# Altium project audio_interface.PrjPcb (part 1 of 2)
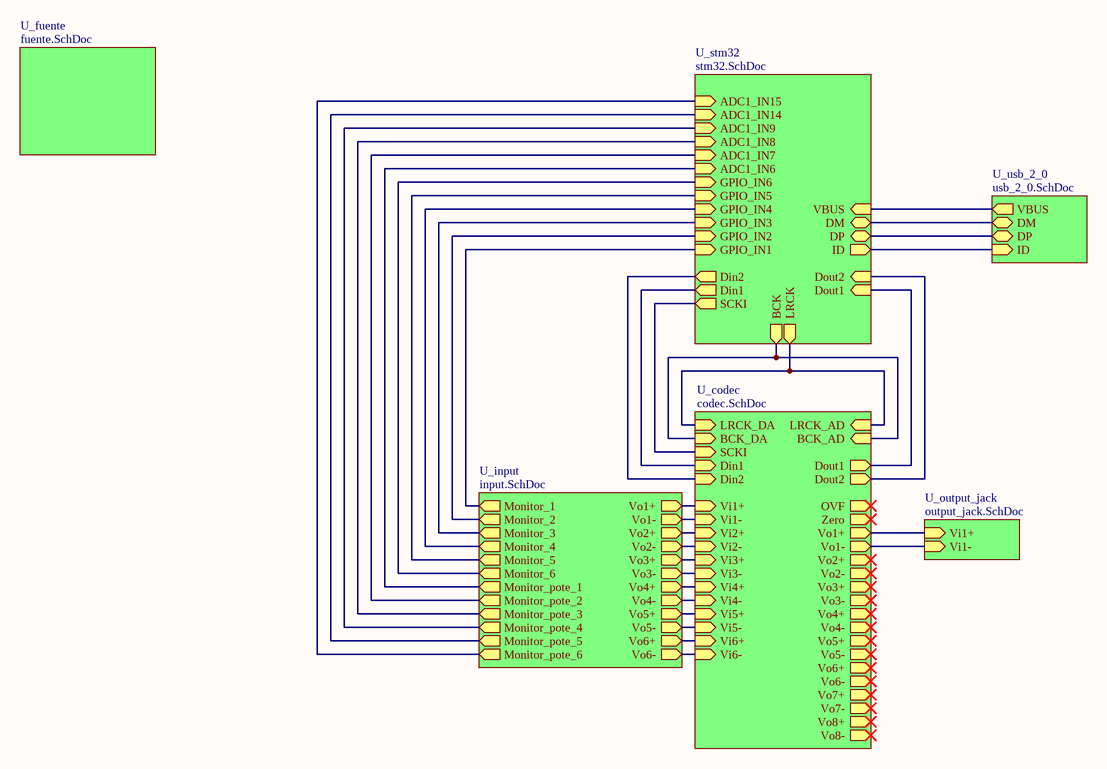
[diagram p0: audio_interface.SchDoc]
14 sheets, 456 parts. Net scope: hierarchical (ports join the sheet entries above them; power ports are global).
Board files: PCB2.PcbDoc, PCB1.PcbDoc, PCB3.PcbDoc
Sheets:
  audio_interface.SchDoc
    U_usb_2_0 = usb_2_0.SchDoc
    U_stm32 = stm32.SchDoc
    U_fuente = fuente.SchDoc
      U_phantom_power = phantom_power.SchDoc
    U_codec = codec.SchDoc
    U_output_jack = output_jack.SchDoc
    U_input = input.SchDoc
      U_input_output_1 = input_output.SchDoc
      U_att_17db_1 = att_17db.SchDoc
      U_preamp_1 = preamp.SchDoc
      U_preamp_2 = preamp.SchDoc
      U_bal2un_2 = bal2un_2.SchDoc
      U_bal2un_1 = bal2un_1.SchDoc
      U_preamp_3 = preamp.SchDoc
      U_phantom_power_enabler_1 = phantom_power_enabler.SchDoc
      U_input_output_2 = input_output.SchDoc
      U_att_17db_2 = att_17db.SchDoc
      U_phantom_power_enabler_2 = phantom_power_enabler.SchDoc
      U_input_output_3 = input_output.SchDoc
      U_att_17db_3 = att_17db.SchDoc
      U_phantom_power_enabler_3 = phantom_power_enabler.SchDoc
      U_input_output_4 = input_output.SchDoc
      U_att_17db_4 = att_17db.SchDoc
      U_phantom_power_enabler_4 = phantom_power_enabler.SchDoc
      U_input_output_5 = input_output.SchDoc
      U_att_17db_5 = att_17db.SchDoc
      U_phantom_power_enabler_5 = phantom_power_enabler.SchDoc
      U_input_output_6 = input_output.SchDoc
      U_att_17db_6 = att_17db.SchDoc
      U_phantom_power_enabler_6 = phantom_power_enabler.SchDoc

## Sheet audio_interface.SchDoc
size A4

### Sub-sheets
U_codec = codec.SchDoc: OVF (out), Vo1+ (out), Zero (out), Vo1- (out), Vo2+ (out), Vo3+ (out), Vo2- (out), Vo3- (out), Vo4+ (out), Vo4- (out), Vo5+ (out), Vo5- (out), Vo6+ (out), Vo7+ (out), Vo6- (out), Vo7- (out), Vo8+ (out), Vo8- (out), Vi1+ (in), Vi1- (in), Vi2+ (in), Vi2- (in), Vi3+ (in), Vi3- (in), Vi4+ (in), Vi4- (in), Vi5+ (in), Vi5- (in), Vi6+ (in), Vi6- (in), Dout1 (out), Dout2 (out), LRCK_DA (in), BCK_DA (in), SCKI (in), Din1 (in), Din2 (in), LRCK_AD (in), BCK_AD (in)
U_fuente = fuente.SchDoc: no entries
U_input = input.SchDoc: Vo1+ (out), Vo1- (out), Vo2+ (out), Vo2- (out), Vo3+ (out), Vo3- (out), Vo4+ (out), Vo4- (out), Vo5+ (out), Vo5- (out), Vo6+ (out), Vo6- (out), Monitor_1 (out), Monitor_pote_5 (out), Monitor_pote_3 (out), Monitor_3 (out), Monitor_4 (out), Monitor_pote_6 (out), Monitor_2 (out), Monitor_6 (out), Monitor_pote_1 (out), Monitor_pote_4 (out), Monitor_pote_2 (out), Monitor_5 (out)
U_output_jack = output_jack.SchDoc: Vi1+ (in), Vi1- (in)
U_stm32 = stm32.SchDoc: Din1 (out), Dout1 (in), BCK (out), LRCK (out), SCKI (out), Din2 (out), Dout2 (in), VBUS (in), DM (bidir), ID (out), DP (bidir), GPIO_IN4 (in), GPIO_IN6 (in), GPIO_IN2 (in), ADC1_IN9 (in), ADC1_IN6 (in), GPIO_IN1 (in), GPIO_IN3 (in), ADC1_IN8 (in), ADC1_IN14 (in), GPIO_IN5 (in), ADC1_IN15 (in), ADC1_IN7 (in)
U_usb_2_0 = usb_2_0.SchDoc: ID (in), DM (bidir), DP (bidir), VBUS (out)

### Nets
NetC33_1: sheet U_codec/Vi1+, sheet U_input/Vo1+
NetC34_1: sheet U_codec/Vi1-, sheet U_input/Vo1-
NetC37_1: sheet U_codec/Vi2+, sheet U_input/Vo2+
NetC38_1: sheet U_codec/Vi2-, sheet U_input/Vo2-
NetC39_1: sheet U_codec/Vi3+, sheet U_input/Vo3+
NetC40_1: sheet U_codec/Vi3-, sheet U_input/Vo3-
NetC41_1: sheet U_codec/Vi4+, sheet U_input/Vo4+
NetC42_1: sheet U_codec/Vi4-, sheet U_input/Vo4-
NetC43_1: sheet U_codec/Vi5+, sheet U_input/Vo5+
NetC44_1: sheet U_codec/Vi5-, sheet U_input/Vo5-
NetC45_1: sheet U_codec/Vi6+, sheet U_input/Vo6+
NetC46_1: sheet U_codec/Vi6-, sheet U_input/Vo6-
NetC49_1_1: sheet U_stm32/ADC1_IN6, sheet U_input/Monitor_pote_1
NetC49_2_1: sheet U_stm32/GPIO_IN2, sheet U_input/Monitor_2
NetC49_3_1: sheet U_stm32/ADC1_IN8, sheet U_input/Monitor_pote_3
NetC49_4_1: sheet U_stm32/ADC1_IN9, sheet U_input/Monitor_pote_4
NetC49_5_1: sheet U_stm32/GPIO_IN5, sheet U_input/Monitor_5
NetC49_6_1: sheet U_stm32/ADC1_IN15, sheet U_input/Monitor_pote_6
NetC50_1_1: sheet U_stm32/GPIO_IN1, sheet U_input/Monitor_1
NetC50_2_1: sheet U_stm32/ADC1_IN7, sheet U_input/Monitor_pote_2
NetC50_3_1: sheet U_stm32/GPIO_IN3, sheet U_input/Monitor_3
NetC50_4_1: sheet U_stm32/GPIO_IN4, sheet U_input/Monitor_4
NetC50_5_1: sheet U_stm32/ADC1_IN14, sheet U_input/Monitor_pote_5
NetC50_6_1: sheet U_stm32/GPIO_IN6, sheet U_input/Monitor_6
NetC62_2: sheet U_codec/Vo1+, sheet U_output_jack/Vi1+
NetC65_2: sheet U_codec/Vo1-, sheet U_output_jack/Vi1-
NetR4_2: sheet U_usb_2_0/VBUS, sheet U_stm32/VBUS
NetR5_2: sheet U_usb_2_0/DM, sheet U_stm32/DM
NetR6_2: sheet U_usb_2_0/DP, sheet U_stm32/DP
NetR7_2: sheet U_usb_2_0/ID, sheet U_stm32/ID
NetR12_2: sheet U_stm32/LRCK, sheet U_codec/LRCK_DA, sheet U_codec/LRCK_AD
NetR14_2: sheet U_stm32/BCK, sheet U_codec/BCK_DA, sheet U_codec/BCK_AD
NetR16_2: sheet U_stm32/SCKI, sheet U_codec/SCKI
NetR17_1: sheet U_stm32/Dout1, sheet U_codec/Dout1
NetR18_2: sheet U_stm32/Din1, sheet U_codec/Din1
NetR19_1: sheet U_stm32/Dout2, sheet U_codec/Dout2
NetR20_2: sheet U_stm32/Din2, sheet U_codec/Din2

### Notes on the sheet
- Title:
- Size:
- Author:
- A4
- Sheet
- of
- Revision:
- File:
- Date:

## Sheet usb_2_0.SchDoc
size A4
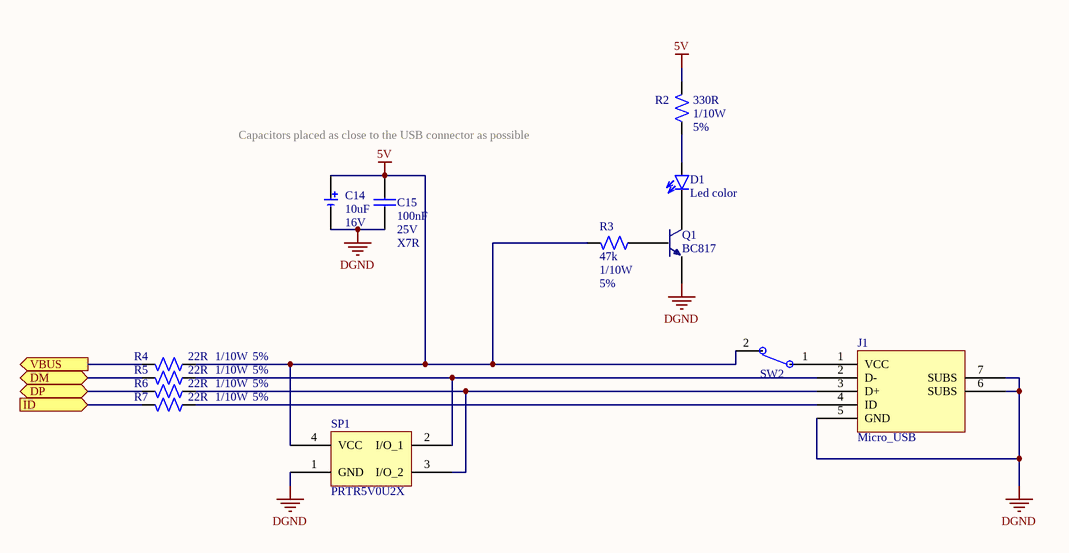
[diagram p1: usb_2_0.SchDoc]

### Parts
C14  Valor: 10uF  tension: 16V  [CAP_Electrolytic]  (hidden comment: Capacitor polarizado)
C15  valor: 100nF  tension: 25V  tolerancia: X7R  [C0805]  (hidden comment: Capacitor)
D1  Led color  [SMD_0805_Diodo]
J1  Micro_USB  [USB Type B]
Q1  BC817  [SOT23]
R2  Valor: 330R  Potencia: 1/10W  Tolerancia: 5%  [R0805]  (hidden comment: Resistor)
R3  Valor: 47k  Potencia: 1/10W  Tolerancia: 5%  [R0805]  (hidden comment: Resistor)
R4  Valor: 22R  Potencia: 1/10W  Tolerancia: 5%  [R0805]  (hidden comment: Resistor)
R5  Valor: 22R  Potencia: 1/10W  Tolerancia: 5%  [R0805]  (hidden comment: Resistor)
R6  Valor: 22R  Potencia: 1/10W  Tolerancia: 5%  [R0805]  (hidden comment: Resistor)
R7  Valor: 22R  Potencia: 1/10W  Tolerancia: 5%  [R0805]  (hidden comment: Resistor)
SP1  PRTR5V0U2X  [SOT143B]
SW2  OnOff_SW_SPST  [SPST_TH_SW_Button_90º]  (value not drawn)

### Ports
DM (bidir), DP (bidir), ID (in), VBUS (out)

### Nets
5V: C14.1 C15.1 R2.2 R3.2 R4.1 SP1.4(VCC) SW2.2
DGND: C14.2 C15.2 J1.5(GND) J1.6(SUBS) J1.7(SUBS) Q1.2 SP1.1(GND)
NetD1_1: D1.1 Q1.3
NetD1_2: D1.2 R2.1
NetJ1_1: J1.1(VCC) SW2.1
NetJ1_2: J1.2(D-) R5.1 SP1.2(I/O_1)
NetJ1_3: J1.3(D+) R6.1 SP1.3(I/O_2)
NetJ1_4: J1.4(ID) R7.1
NetQ1_1: Q1.1 R3.1
NetR4_2: R4.2 ; port VBUS
NetR5_2: R5.2 ; port DM
NetR6_2: R6.2 ; port DP
NetR7_2: R7.2 ; port ID

### Notes on the sheet
- Capacitors placed as close to the USB connector as possible

### Library data of the parts
C15 = Capacitor: Capacitor de placas paralelas; Encapsulado: 0805
D1 = Led: Encapsulado: SMD; Cod. Proveedor: 67-1549-1-ND; Proveedor: Digi-Key; Color: Verde; Link: https://www.digikey.com/product-detail/es/SML-LX0603GW-TR/67-1549-1-ND/304360?utm_campaign=buynow&WT.z_cid=ref_octopart_dkc_buynow&utm_medium=aggregator&curr=usd&site=us&utm_source=octopart
J1 = Micro_USB: Conector micro USB tipo B; pin to pad: 7>6; Cod. Proveedor: CO4821095; Proveedor: Elemon; Encapsulado: SMD B TYPE SIDE ENTRY; Fabricante: *; Link: *
Q1 = NPN: Cod. Proveedor: 1727-2918-1-ND; Encapsulado: TO-236AB; Proveedor: Digi-Key; Fabricante: Nexperia USA Inc.; Link: https://www.digikey.com/products/es?keywords=1727-2918-1-ND
R2-R7 = Resistor: Resistencia
SP1 = Double ESD: Double rail-to-rail ESD protection diode; Cod. Proveedor: 1727-3884-1-ND; Proveedor: Digi-Key; Encapsulado: SOT-143B; Link: https://www.digikey.com/product-detail/es/PRTR5V0U2X,215/1727-3884-1-ND/1589981?utm_campaign=buynow&WT.z_cid=ref_octopart_dkc_buynow&utm_medium=aggregator&curr=usd&site=us&utm_source=octopart
SW2 = OnOff_SW_SPST: Cod. Proveedor: EG2615-ND; Encapsulado: SMD; Proveedor: Digi-Key; Fabricante: E-Switch; Link: https://www.digikey.com/product-detail/en/e-switch/800SP9B6M6RE/EG2615-ND/502079
C14 = Capacitor polarizado: Link: *; Fabricante: *

## Sheet stm32.SchDoc
size A4
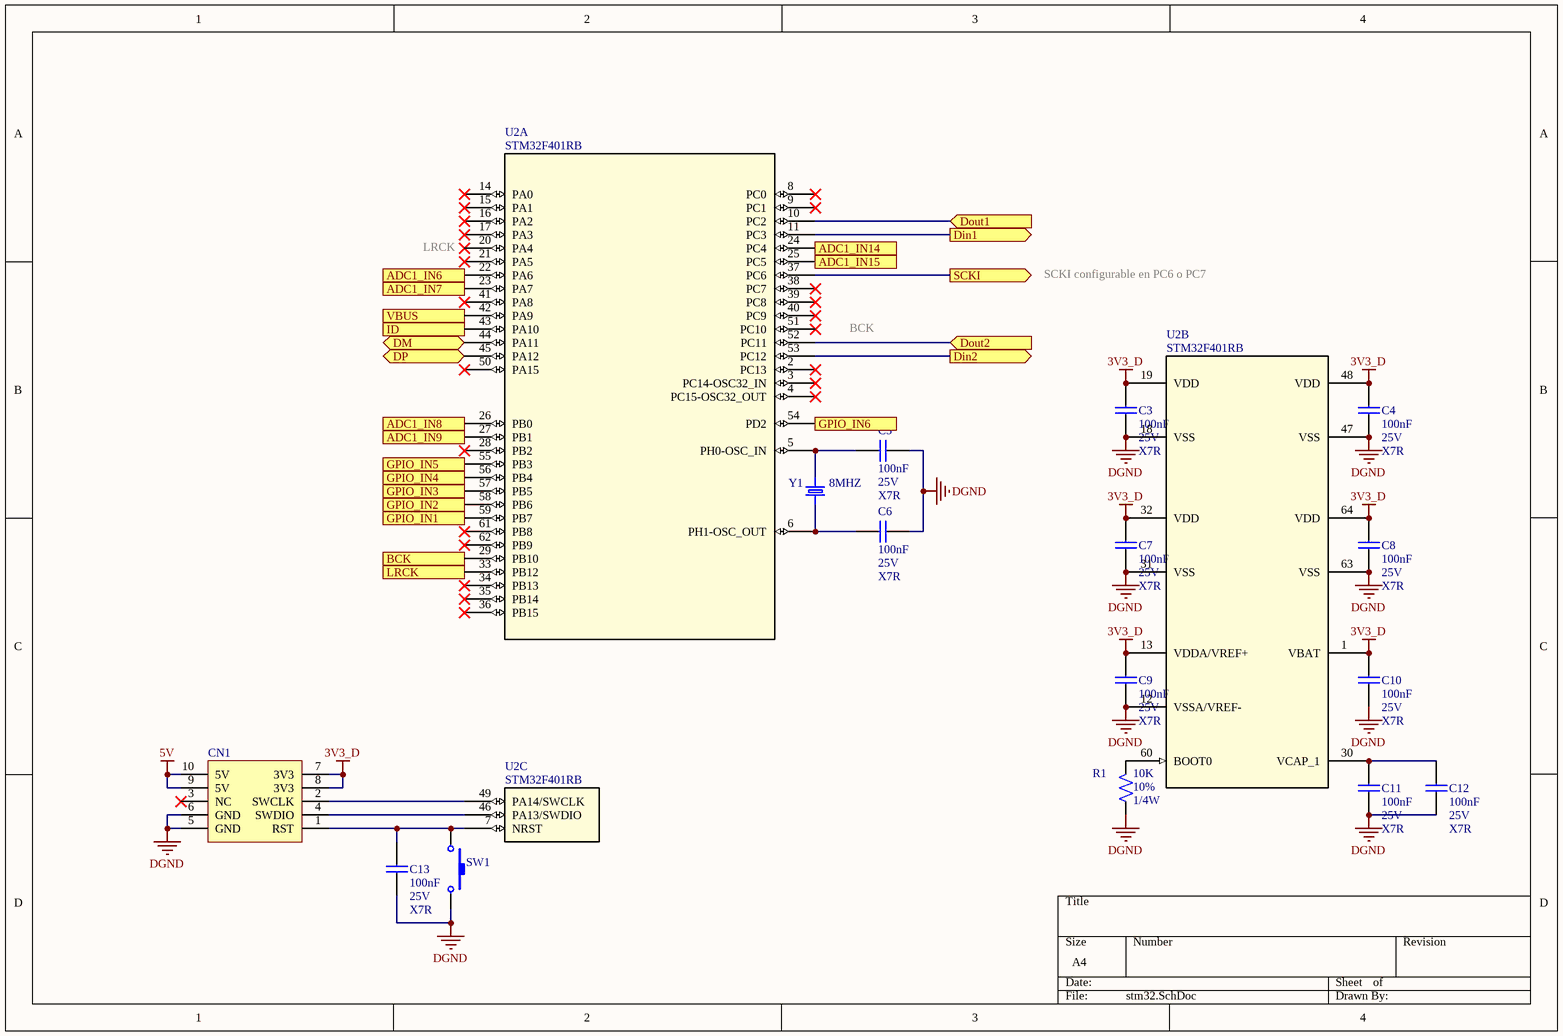
[diagram p2: stm32.SchDoc]

### Parts
C3  valor: 100nF  tension: 25V  tolerancia: X7R  [C0805]  (hidden comment: Capacitor)
C4  valor: 100nF  tension: 25V  tolerancia: X7R  [C0805]  (hidden comment: Capacitor)
C5  valor: 100nF  tension: 25V  tolerancia: X7R  [C0805]  (hidden comment: Capacitor)
C6  valor: 100nF  tension: 25V  tolerancia: X7R  [C0805]  (hidden comment: Capacitor)
C7  valor: 100nF  tension: 25V  tolerancia: X7R  [C0805]  (hidden comment: Capacitor)
C8  valor: 100nF  tension: 25V  tolerancia: X7R  [C0805]  (hidden comment: Capacitor)
C9  valor: 100nF  tension: 25V  tolerancia: X7R  [C0805]  (hidden comment: Capacitor)
C10  valor: 100nF  tension: 25V  tolerancia: X7R  [C0805]  (hidden comment: Capacitor)
C11  valor: 100nF  tension: 25V  tolerancia: X7R  [C0805]  (hidden comment: Capacitor)
C12  valor: 100nF  tension: 25V  tolerancia: X7R  [C0805]  (hidden comment: Capacitor)
C13  valor: 100nF  tension: 25V  tolerancia: X7R  [C0805]  (hidden comment: Capacitor)
CN1  STLINK V2 Mini_2  [IDC10M]  (value not drawn)
R1  Valor: 10K  Potencia: 1/4W  Tolerancia: 10%  [R0805]  (hidden comment: Resistor)
SW1  TAC_SWITCH_4  [TAC_SW_4]  (value not drawn)
U2  STM32F401RB  [LQFP64-10x10mm]  (parts A,B,C of 3)
Y1  frecuencia: 8MHZ  [XTAL_HC49/US_HS]  (hidden comment: XTAL)

### Ports
ADC1_IN6 (in), ADC1_IN7 (in), ADC1_IN8 (in), ADC1_IN9 (in), ADC1_IN14 (in), ADC1_IN15 (in), BCK (out), Din1 (out), Din2 (out), DM (bidir), Dout1 (in), Dout2 (in), DP (bidir), GPIO_IN1 (in), GPIO_IN2 (in), GPIO_IN3 (in), GPIO_IN4 (in), GPIO_IN5 (in), GPIO_IN6 (in), ID (out), LRCK (out), SCKI (out), VBUS (in)

### Nets
3V3_D: C3.1 C4.1 C7.1 C8.1 C9.1 C10.1 CN1.7(3V3) CN1.8(3V3) U2.1(VBAT) U2.13(VDDA/VREF+) U2.19(VDD) U2.32(VDD) U2.48(VDD) U2.64(VDD)
5V: CN1.9(5V) CN1.10(5V)
DGND: C3.2 C4.2 C5.1 C6.1 C7.2 C8.2 C9.2 C10.2 C11.2 C12.2 C13.2 CN1.5(GND) CN1.6(GND) R1.1 SW1.2 U2.12(VSSA/VREF-) U2.18(VSS) U2.31(VSS) U2.47(VSS) U2.63(VSS)
NetC5_2: C5.2 U2.5(PH0-OSC_IN) Y1.1
NetC6_2: C6.2 U2.6(PH1-OSC_OUT) Y1.2
NetC11_1: C11.1 C12.1 U2.30(VCAP_1)
NetC13_1: C13.1 CN1.1(RST) SW1.1 U2.7(NRST)
NetC49_1_1: U2.22(PA6) ; port ADC1_IN6
NetC49_2_1: U2.58(PB6) ; port GPIO_IN2
NetC49_3_1: U2.26(PB0) ; port ADC1_IN8
NetC49_4_1: U2.27(PB1) ; port ADC1_IN9
NetC49_5_1: U2.55(PB3) ; port GPIO_IN5
NetC49_6_1: U2.25(PC5) ; port ADC1_IN15
NetC50_1_1: U2.59(PB7) ; port GPIO_IN1
NetC50_2_1: U2.23(PA7) ; port ADC1_IN7
NetC50_3_1: U2.57(PB5) ; port GPIO_IN3
NetC50_4_1: U2.56(PB4) ; port GPIO_IN4
NetC50_5_1: U2.24(PC4) ; port ADC1_IN14
NetC50_6_1: U2.54(PD2) ; port GPIO_IN6
NetCN1_2: CN1.2(SWCLK) U2.49(PA14/SWCLK)
NetCN1_4: CN1.4(SWDIO) U2.46(PA13/SWDIO)
NetR1_2: R1.2 U2.60(BOOT0)
NetR4_2: U2.42(PA9) ; port VBUS
NetR5_2: U2.44(PA11) ; port DM
NetR6_2: U2.45(PA12) ; port DP
NetR7_2: U2.43(PA10) ; port ID
NetR12_2: U2.33(PB12) ; port LRCK
NetR14_2: U2.29(PB10) ; port BCK
NetR16_2: U2.37(PC6) ; port SCKI
NetR17_1: U2.10(PC2) ; port Dout1
NetR18_2: U2.11(PC3) ; port Din1
NetR19_1: U2.52(PC11) ; port Dout2
NetR20_2: U2.53(PC12) ; port Din2

Not connected (* = marked no-connect by the designer): CN1 3(NC)*; U2 2(PC13)* 3(PC14-OSC32_IN)* 4(PC15-OSC32_OUT)* 8(PC0)* 9(PC1)* 14(PA0)* 15(PA1)* 16(PA2)* 17(PA3)* 20(PA4)* 21(PA5)* 28(PB2)* 34(PB13)* 35(PB14)* 36(PB15)* 38(PC7)* 39(PC8)* 40(PC9)* 41(PA8)* 50(PA15)* 51(PC10)* 61(PB8)* 62(PB9)*

### Notes on the sheet
- LRCK
- SCKI configurable en PC6 o PC7
- BCK

### Library data of the parts
C3-C13 = Capacitor: as C15 on sheet usb_2_0
CN1 = STLINK V2 Mini_2: STLINK V2 Mini; Link: *; Fabricante: *
R1 = Resistor: Resistencia
SW1 = TAC_SWITCH_4: Pulsador de 4 pines
U2 = STM32F4xxR2: Vendor: STMicroelectronics; _BOOT0=1: 1: System memory is selected as boot space; _BOOT0=0: 0: Main Flash memory is selected as boot space; _VDD: Capa de 100nF; _BOOT0: conectado a VDD o DGND a traves de R=10K; Proveedor: Digi-Key; Cod. Proveedor: 497-17428-ND; Encapsulado: 64-LQFP; Manufacturer_Part_Number: stm32f4xxr2; Value: Value; Link: https://www.digikey.com/product-detail/es/STM32F401RBT6/497-17428-ND/4755972?utm_campaign=buynow&WT.z_cid=ref_octopart_dkc_buynow&utm_medium=aggregator&curr=usd&site=us&utm_source=octopart; Manufacturer: STMicroelectronics
Y1 = XTAL: Resonador cerámico

## Sheet fuente.SchDoc
size A4
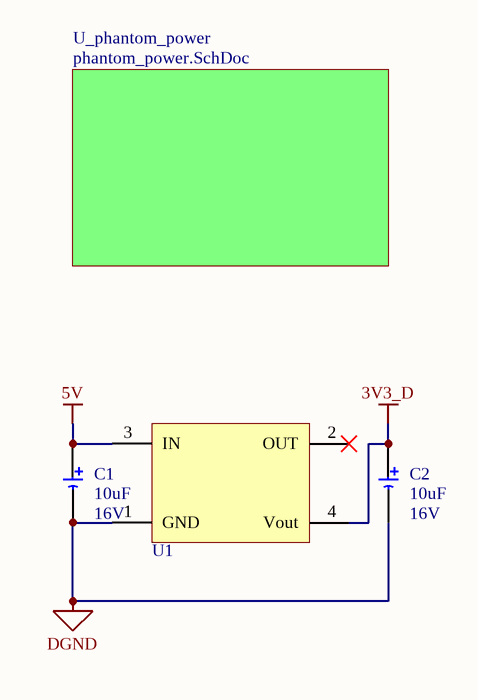
[diagram p3: fuente.SchDoc]

### Parts
C1  Valor: 10uF  tension: 16V  [CAP_Electrolytic]  (hidden comment: Capacitor polarizado)
C2  Valor: 10uF  tension: 16V  [CAP_Electrolytic]  (hidden comment: Capacitor polarizado)
U1  LM1117  [SOT223]  (value not drawn)

### Sub-sheets
U_phantom_power = phantom_power.SchDoc: no entries

### Nets
3V3_D: C2.1 U1.4(Vout)
5V: C1.1 U1.3(IN)
DGND: C1.2 C2.2 U1.1(GND)

Not connected (* = marked no-connect by the designer): U1 2(OUT)*

### Library data of the parts
U1 = LM1117: LDO Regulator; Cod. Proveedor: LM1117IMP-ADJ/NOPBCT-ND; Proveedor: Digi-Key; Encapsulado: SOT-223-4; Fabricante: Texas Instruments; Link: https://www.digikey.com/product-detail/es/LM1117IMP-ADJ-NOPB/LM1117IMP-ADJ-NOPBCT-ND/483060?utm_campaign=buynow&WT.z_cid=ref_octopart_dkc_buynow&utm_medium=aggregator&curr=usd&site=us&utm_source=octopart
C1 C2 = Capacitor polarizado: Link: *; Fabricante: *

## Sheet phantom_power.SchDoc
size A4
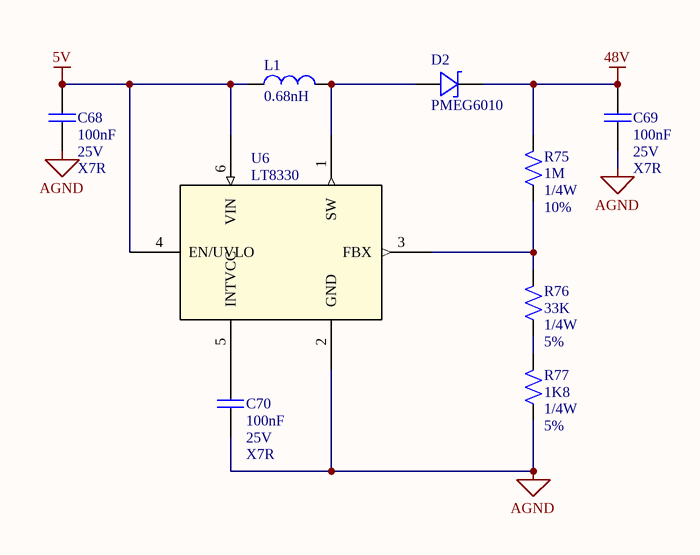
[diagram p4: phantom_power.SchDoc]

### Parts
C68  valor: 100nF  tension: 25V  tolerancia: X7R  [C0805]  (hidden comment: Capacitor)
C69  valor: 100nF  tension: 25V  tolerancia: X7R  [C0805]  (hidden comment: Capacitor)
C70  valor: 100nF  tension: 25V  tolerancia: X7R  [C0805]  (hidden comment: Capacitor)
D2  PMEG6010  [SOD128]
L1  0.68nH  [L0805]
R75  Valor: 1M  Potencia: 1/4W  Tolerancia: 10%  [R0805]  (hidden comment: Resistor)
R76  Valor: 33K  Potencia: 1/4W  Tolerancia: 5%  [R0805]  (hidden comment: Resistor)
R77  Valor: 1K8  Potencia: 1/4W  Tolerancia: 5%  [R0805]  (hidden comment: Resistor)
U6  LT8330  [S6]

### Nets
5V: C68.1 L1.1 U6.4(EN/UVLO) U6.6(VIN)
48V: C69.1 D2.1 R75.2
AGND: C68.2 C69.2 C70.2 R77.1 U6.2(GND)
NetC70_1: C70.1 U6.5(INTVCC)
NetD2_2: D2.2 L1.2 U6.1(SW)
NetR75_1: R75.1 R76.2 U6.3(FBX)
NetR76_1: R76.1 R77.2

### Library data of the parts
C68-C70 = Capacitor: as C15 on sheet usb_2_0
D2 = Schottky Diode: Cod. Proveedor: 1727-5845-1-ND; Encapsulado: SOD-128; Proveedor: Digi-Key; Fabricante: Nexperia; Link: https://www.digikey.com/product-detail/es/PMEG6010EP,115/1727-5845-1-ND/2697507?utm_campaign=buynow&WT.z_cid=ref_octopart_dkc_buynow&utm_medium=aggregator&curr=usd&site=us&utm_source=octopart
L1 = Inductor: Encapsulado: SMD; Proveedor: Digi-Key; Cod. Proveedor: 478-7137-1-ND; Fabricante: AVX Corporation; Valor: 0.68nH; Link: https://www.digikey.com/product-detail/es/L0201R68AHSTR/500/478-7137-1-ND/3455469?utm_campaign=buynow&WT.z_cid=ref_octopart_dkc_buynow&utm_medium=aggregator&curr=usd&site=us&utm_source=octopart
R75-R77 = Resistor: Resistencia
U6 = LT8330: Low IQ Boost/SEPIC/Inverting Converter with 1A, 60V Switch; Fabricante: Linear Technology/Analog Devices; Cod. Proveedor: LT8330ES6#TRMPBFCT-ND; Encapsulado: TSOT-23-6; Proveedor: Digi-Key; Link: https://www.digikey.com/product-detail/es/LT8330ES6%2523TRMPBF/LT8330ES6%2523TRMPBFCT-ND/5361671?utm_campaign=buynow&WT.z_cid=ref_octopart_dkc_buynow&utm_medium=aggregator&curr=usd&site=us&utm_source=octopart

## Sheet codec.SchDoc
size A4
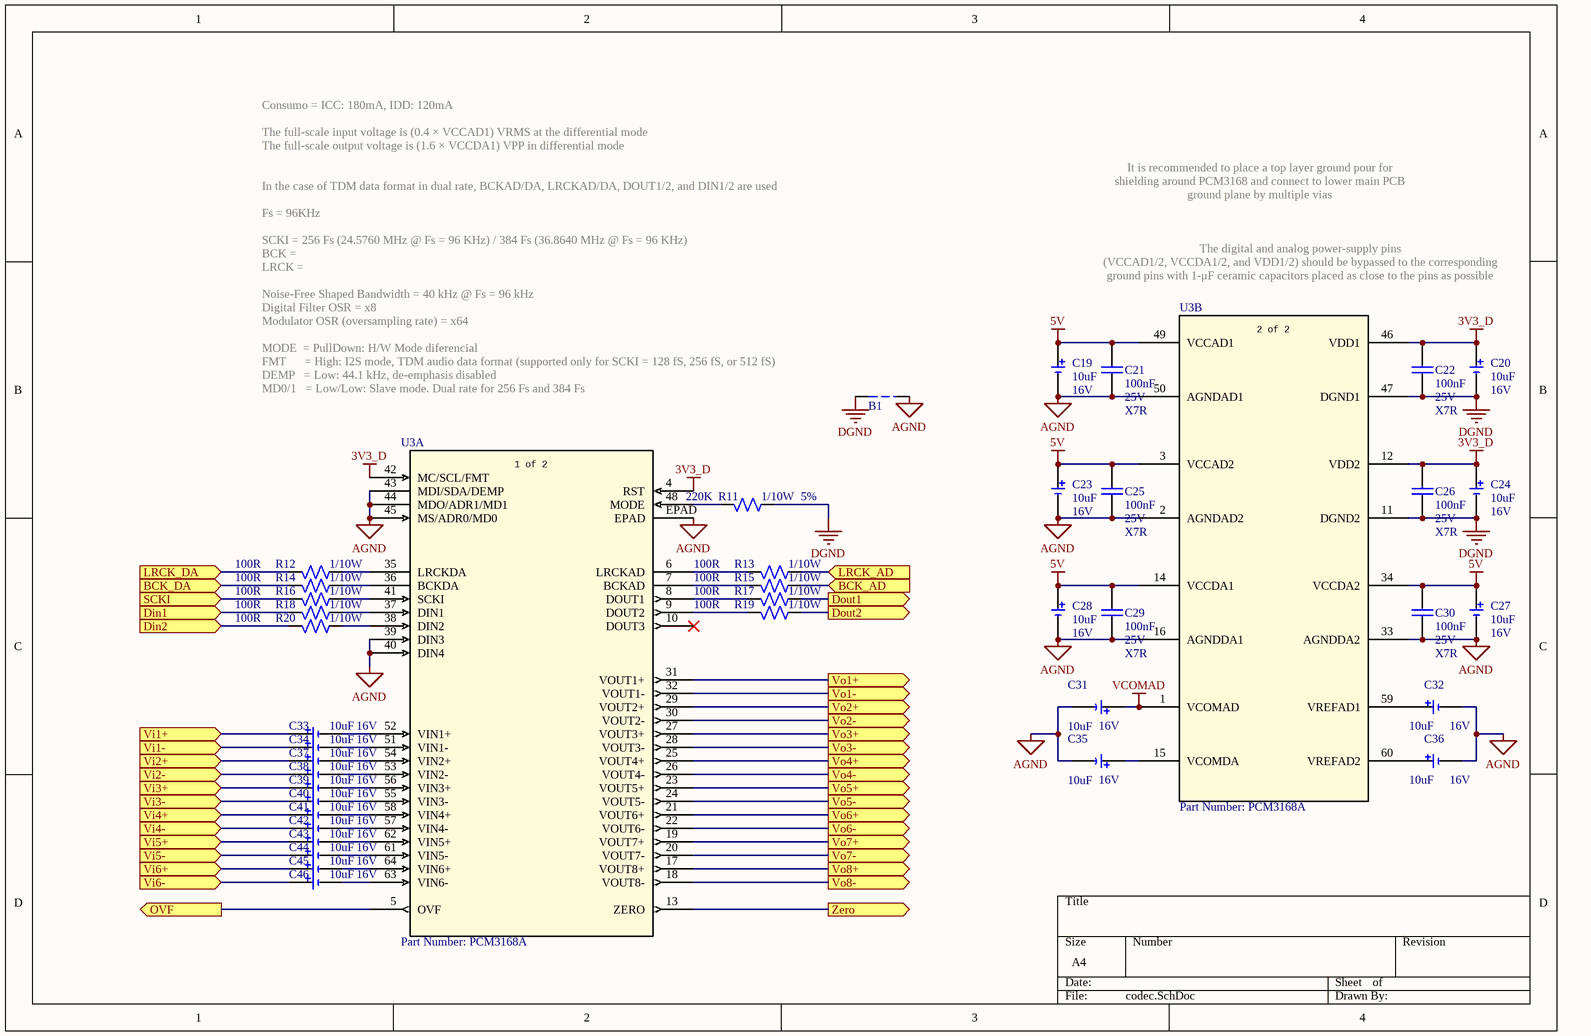
[diagram p5: codec.SchDoc]

### Parts
B1  GND_BIND  [Track_8mil]  (value not drawn)
C19  Valor: 10uF  tension: 16V  [CAP_Electrolytic]  (hidden comment: Capacitor polarizado)
C20  Valor: 10uF  tension: 16V  [CAP_Electrolytic]  (hidden comment: Capacitor polarizado)
C21  valor: 100nF  tension: 25V  tolerancia: X7R  [C0805]  (hidden comment: Capacitor)
C22  valor: 100nF  tension: 25V  tolerancia: X7R  [C0805]  (hidden comment: Capacitor)
C23  Valor: 10uF  tension: 16V  [CAP_Electrolytic]  (hidden comment: Capacitor polarizado)
C24  Valor: 10uF  tension: 16V  [CAP_Electrolytic]  (hidden comment: Capacitor polarizado)
C25  valor: 100nF  tension: 25V  tolerancia: X7R  [C0805]  (hidden comment: Capacitor)
C26  valor: 100nF  tension: 25V  tolerancia: X7R  [C0805]  (hidden comment: Capacitor)
C27  Valor: 10uF  tension: 16V  [CAP_Electrolytic]  (hidden comment: Capacitor polarizado)
C28  Valor: 10uF  tension: 16V  [CAP_Electrolytic]  (hidden comment: Capacitor polarizado)
C29  valor: 100nF  tension: 25V  tolerancia: X7R  [C0805]  (hidden comment: Capacitor)
C30  valor: 100nF  tension: 25V  tolerancia: X7R  [C0805]  (hidden comment: Capacitor)
C31  Valor: 10uF  tension: 16V  [CAP_Electrolytic]  (hidden comment: Capacitor polarizado)
C32  Valor: 10uF  tension: 16V  [CAP_Electrolytic]  (hidden comment: Capacitor polarizado)
C33  Valor: 10uF  tension: 16V  [CAP_Electrolytic]  (hidden comment: Capacitor polarizado)
C34  Valor: 10uF  tension: 16V  [CAP_Electrolytic]  (hidden comment: Capacitor polarizado)
C35  Valor: 10uF  tension: 16V  [CAP_Electrolytic]  (hidden comment: Capacitor polarizado)
C36  Valor: 10uF  tension: 16V  [CAP_Electrolytic]  (hidden comment: Capacitor polarizado)
C37  Valor: 10uF  tension: 16V  [CAP_Electrolytic]  (hidden comment: Capacitor polarizado)
C38  Valor: 10uF  tension: 16V  [CAP_Electrolytic]  (hidden comment: Capacitor polarizado)
C39  Valor: 10uF  tension: 16V  [CAP_Electrolytic]  (hidden comment: Capacitor polarizado)
C40  Valor: 10uF  tension: 16V  [CAP_Electrolytic]  (hidden comment: Capacitor polarizado)
C41  Valor: 10uF  tension: 16V  [CAP_Electrolytic]  (hidden comment: Capacitor polarizado)
C42  Valor: 10uF  tension: 16V  [CAP_Electrolytic]  (hidden comment: Capacitor polarizado)
C43  Valor: 10uF  tension: 16V  [CAP_Electrolytic]  (hidden comment: Capacitor polarizado)
C44  Valor: 10uF  tension: 16V  [CAP_Electrolytic]  (hidden comment: Capacitor polarizado)
C45  Valor: 10uF  tension: 16V  [CAP_Electrolytic]  (hidden comment: Capacitor polarizado)
C46  Valor: 10uF  tension: 16V  [CAP_Electrolytic]  (hidden comment: Capacitor polarizado)
R11  Valor: 220K  Potencia: 1/10W  Tolerancia: 5%  [R0805]  (hidden comment: Resistor)
R12  Valor: 100R  Potencia: 1/10W  [R0805]  (hidden comment: Resistor)
R13  Valor: 100R  Potencia: 1/10W  [R0805]  (hidden comment: Resistor)
R14  Valor: 100R  Potencia: 1/10W  [R0805]  (hidden comment: Resistor)
R15  Valor: 100R  Potencia: 1/10W  [R0805]  (hidden comment: Resistor)
R16  Valor: 100R  Potencia: 1/10W  [R0805]  (hidden comment: Resistor)
R17  Valor: 100R  Potencia: 1/10W  [R0805]  (hidden comment: Resistor)
R18  Valor: 100R  Potencia: 1/10W  [R0805]  (hidden comment: Resistor)
R19  Valor: 100R  Potencia: 1/10W  [R0805]  (hidden comment: Resistor)
R20  Valor: 100R  Potencia: 1/10W  [R0805]  (hidden comment: Resistor)
U3  Part Number: PCM3168A  [PAP64_7X7P26]  (parts A,B of 2)

### Ports
BCK_AD (in), BCK_DA (in), Din1 (in), Din2 (in), Dout1 (out), Dout2 (out), LRCK_AD (in), LRCK_DA (in), OVF (out), SCKI (in), Vi1+ (in), Vi1- (in), Vi2+ (in), Vi2- (in), Vi3+ (in), Vi3- (in), Vi4+ (in), Vi4- (in), Vi5+ (in), Vi5- (in), Vi6+ (in), Vi6- (in), Vo1+ (out), Vo1- (out), Vo2+ (out), Vo2- (out), Vo3+ (out), Vo3- (out), Vo4+ (out), Vo4- (out), Vo5+ (out), Vo5- (out), Vo6+ (out), Vo6- (out), Vo7+ (out), Vo7- (out), Vo8+ (out), Vo8- (out), Zero (out)

### Nets
3V3_D: C20.1 C22.1 C24.1 C26.1 U3.4(RST) U3.12(VDD2) U3.42(MC/SCL/FMT) U3.46(VDD1)
5V: C19.1 C21.1 C23.1 C25.1 C27.1 C28.1 C29.1 C30.1 U3.3(VCCAD2) U3.14(VCCDA1) U3.34(VCCDA2) U3.49(VCCAD1)
AGND: B1.1 C19.2 C21.2 C23.2 C25.2 C27.2 C28.2 C29.2 C30.2 C31.2 C32.2 C35.2 C36.2 U3.2(AGNDAD2) U3.16(AGNDDA1) U3.33(AGNDDA2) U3.39(DIN3) U3.40(DIN4) U3.43(MDI/SDA/DEMP) U3.44(MDO/ADR1/MD1) U3.45(MS/ADR0/MD0) U3.50(AGNDAD1) U3.EPAD
DGND: B1.2 C20.2 C22.2 C24.2 C26.2 R11.1 U3.11(DGND2) U3.47(DGND1)
VCOMAD: C31.1 U3.1(VCOMAD)
NetC32_1: C32.1 U3.59(VREFAD1)
NetC33_1: C33.1 ; port Vi1+
NetC33_2: C33.2 U3.52(VIN1+)
NetC34_1: C34.1 ; port Vi1-
NetC34_2: C34.2 U3.51(VIN1-)
NetC35_1: C35.1 U3.15(VCOMDA)
NetC36_1: C36.1 U3.60(VREFAD2)
NetC37_1: C37.1 ; port Vi2+
NetC37_2: C37.2 U3.54(VIN2+)
NetC38_1: C38.1 ; port Vi2-
NetC38_2: C38.2 U3.53(VIN2-)
NetC39_1: C39.1 ; port Vi3+
NetC39_2: C39.2 U3.56(VIN3+)
NetC40_1: C40.1 ; port Vi3-
NetC40_2: C40.2 U3.55(VIN3-)
NetC41_1: C41.1 ; port Vi4+
NetC41_2: C41.2 U3.58(VIN4+)
NetC42_1: C42.1 ; port Vi4-
NetC42_2: C42.2 U3.57(VIN4-)
NetC43_1: C43.1 ; port Vi5+
NetC43_2: C43.2 U3.62(VIN5+)
NetC44_1: C44.1 ; port Vi5-
NetC44_2: C44.2 U3.61(VIN5-)
NetC45_1: C45.1 ; port Vi6+
NetC45_2: C45.2 U3.64(VIN6+)
NetC46_1: C46.1 ; port Vi6-
NetC46_2: C46.2 U3.63(VIN6-)
NetC62_2: U3.31(VOUT1+) ; port Vo1+
NetC65_2: U3.32(VOUT1-) ; port Vo1-
NetR11_2: R11.2 U3.48(MODE)
NetR12_1: R12.1 U3.35(LRCKDA)
NetR12_2: R12.2 R13.1 ; port LRCK_AD, port LRCK_DA
NetR13_2: R13.2 U3.6(LRCKAD)
NetR14_1: R14.1 U3.36(BCKDA)
NetR14_2: R14.2 R15.1 ; port BCK_AD, port BCK_DA
NetR15_2: R15.2 U3.7(BCKAD)
NetR16_1: R16.1 U3.41(SCKI)
NetR16_2: R16.2 ; port SCKI
NetR17_1: R17.1 ; port Dout1
NetR17_2: R17.2 U3.8(DOUT1)
NetR18_1: R18.1 U3.37(DIN1)
NetR18_2: R18.2 ; port Din1
NetR19_1: R19.1 ; port Dout2
NetR19_2: R19.2 U3.9(DOUT2)
NetR20_1: R20.1 U3.38(DIN2)
NetR20_2: R20.2 ; port Din2
NetU3_5: U3.5(OVF) ; port OVF
NetU3_13: U3.13(ZERO) ; port Zero
NetU3_17: U3.17(VOUT8+) ; port Vo8+
NetU3_18: U3.18(VOUT8-) ; port Vo8-
NetU3_19: U3.19(VOUT7+) ; port Vo7+
NetU3_20: U3.20(VOUT7-) ; port Vo7-
NetU3_21: U3.21(VOUT6+) ; port Vo6+
NetU3_22: U3.22(VOUT6-) ; port Vo6-
NetU3_23: U3.23(VOUT5+) ; port Vo5+
NetU3_24: U3.24(VOUT5-) ; port Vo5-
NetU3_25: U3.25(VOUT4+) ; port Vo4+
NetU3_26: U3.26(VOUT4-) ; port Vo4-
NetU3_27: U3.27(VOUT3+) ; port Vo3+
NetU3_28: U3.28(VOUT3-) ; port Vo3-
NetU3_29: U3.29(VOUT2+) ; port Vo2+
NetU3_30: U3.30(VOUT2-) ; port Vo2-

Not connected (* = marked no-connect by the designer): U3 10(DOUT3)*

### Notes on the sheet
- Consumo = ICC: 180mA, IDD: 120mA
- The full-scale output voltage is (1.6 × VCCDA1) VPP in differential mode
- The full-scale input voltage is (0.4 × VCCAD1) VRMS at the differential mode
- It is recommended to place a top layer ground pour for
- shielding around PCM3168 and connect to lower main PCB
- SCKI = 256 Fs (24.5760 MHz @ Fs = 96 KHz) / 384 Fs (36.8640 MHz @ Fs = 96 KHz)
- Fs = 96KHz
- In the case of TDM data format in dual rate, BCKAD/DA, LRCKAD/DA, DOUT1/2, and DIN1/2 are used
- ground plane by multiple vias
- The digital and analog power-supply pins
- Noise-Free Shaped Bandwidth = 40 kHz @ Fs = 96 kHz
- Digital Filter OSR = x8
- BCK =
- LRCK =
- (VCCAD1/2, VCCDA1/2, and VDD1/2) should be bypassed to the corresponding
- ground pins with 1-μF ceramic capacitors placed as close to the pins as possible
- MODE  = PullDown: H/W Mode diferencial
- DEMP   = Low: 44.1 kHz, de-emphasis disabled
- (near B1) FMT      = High: I2S mode, TDM audio data format (supported only for SCKI = 128 fS, 256 fS, or 512 fS)
- Modulator OSR (oversampling rate) = x64
- MD0/1   = Low/Low: Slave mode. Dual rate for 256 Fs and 384 Fs
- (in symbol PCM3168A-Q1_PAP_, part A) 1 of 2
- (in symbol PCM3168A-Q1_PAP_, part B) 2 of 2

### Library data of the parts
B1 = GND_BIND: Conecta distintos planos de masa por una pista
C21 C22 C25 C26 C29 C30 = Capacitor: as C15 on sheet usb_2_0
R11-R20 = Resistor: Resistencia
U3 = PCM3168A-Q1_PAP_: Manufacturer: Texas Instruments; Manufacturer_Part_Number: PCM3168A-Q1_PAP_64; Vendor: Texas Instruments; Cod. Proveedor: *; Encapsulado: *; Link: *; Proveedor: *
C19 C20 C23 C24 C27 C28 C31-C46 = Capacitor polarizado: Link: *; Fabricante: *

## Sheet output_jack.SchDoc
size A4
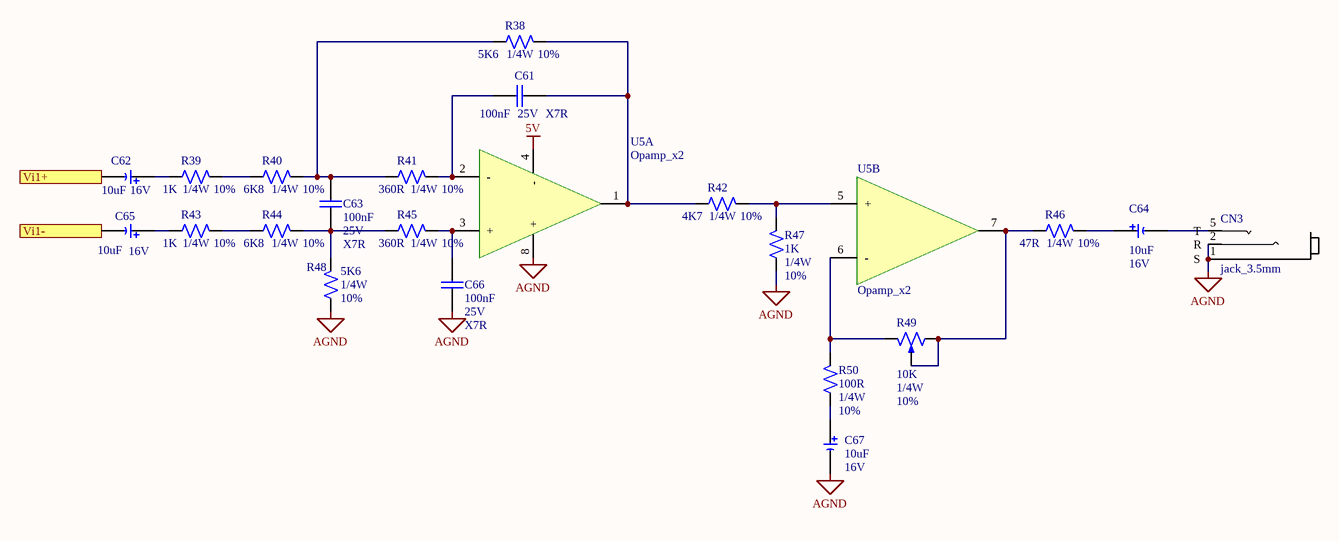
[diagram p6: output_jack.SchDoc]

### Parts
C61  valor: 100nF  tension: 25V  tolerancia: X7R  [C0805]  (hidden comment: Capacitor)
C62  Valor: 10uF  tension: 16V  [CAP_Electrolytic]  (hidden comment: Capacitor polarizado)
C63  valor: 100nF  tension: 25V  tolerancia: X7R  [C0805]  (hidden comment: Capacitor)
C64  Valor: 10uF  tension: 16V  [CAP_Electrolytic]  (hidden comment: Capacitor polarizado)
C65  Valor: 10uF  tension: 16V  [CAP_Electrolytic]  (hidden comment: Capacitor polarizado)
C66  valor: 100nF  tension: 25V  tolerancia: X7R  [C0805]  (hidden comment: Capacitor)
C67  Valor: 10uF  tension: 16V  [CAP_Electrolytic]  (hidden comment: Capacitor polarizado)
CN3  jack_3.5mm  [Jack 3.5mm]
R38  Valor: 5K6  Potencia: 1/4W  Tolerancia: 10%  [R0805]  (hidden comment: Resistor)
R39  Valor: 1K  Potencia: 1/4W  Tolerancia: 10%  [R0805]  (hidden comment: Resistor)
R40  Valor: 6K8  Potencia: 1/4W  Tolerancia: 10%  [R0805]  (hidden comment: Resistor)
R41  Valor: 360R  Potencia: 1/4W  Tolerancia: 10%  [R0805]  (hidden comment: Resistor)
R42  Valor: 4K7  Potencia: 1/4W  Tolerancia: 10%  [R0805]  (hidden comment: Resistor)
R43  Valor: 1K  Potencia: 1/4W  Tolerancia: 10%  [R0805]  (hidden comment: Resistor)
R44  Valor: 6K8  Potencia: 1/4W  Tolerancia: 10%  [R0805]  (hidden comment: Resistor)
R45  Valor: 360R  Potencia: 1/4W  Tolerancia: 10%  [R0805]  (hidden comment: Resistor)
R46  Valor: 47R  Potencia: 1/4W  Tolerancia: 10%  [R0805]  (hidden comment: Resistor)
R47  Valor: 1K  Potencia: 1/4W  Tolerancia: 10%  [R0805]  (hidden comment: Resistor)
R48  Valor: 5K6  Potencia: 1/4W  Tolerancia: 10%  [R0805]  (hidden comment: Resistor)
R49  valor: 10K  Potencia: 1/4W  Tolerancia: 10%  [Header 3x1]  (hidden comment: Potenciometro)
R50  Valor: 100R  Potencia: 1/4W  Tolerancia: 10%  [R0805]  (hidden comment: Resistor)
U5  Opamp_x2  [D8]  (parts A,B of 2)

### Ports
Vi1+ (in), Vi1- (in)

### Nets
5V: U5.4(-)
AGND: C66.2 C67.2 CN3.1(S) CN3.2(R) R47.1 R48.1 U5.8(+)
NetC61_1: C61.1 R38.2 R42.1 U5.1(OUT)
NetC61_2: C61.2 R41.2 U5.2(-)
NetC62_1: C62.1 R39.1
NetC62_2: C62.2 ; port Vi1+
NetC63_1: C63.1 R38.1 R40.2 R41.1
NetC63_2: C63.2 R44.2 R45.1 R48.2
NetC64_1: C64.1 R46.2
NetC64_2: C64.2 CN3.5(T)
NetC65_1: C65.1 R43.1
NetC65_2: C65.2 ; port Vi1-
NetC66_1: C66.1 R45.2 U5.3(+)
NetC67_1: C67.1 R50.1
NetR39_2: R39.2 R40.1
NetR42_2: R42.2 R47.2 U5.5(+)
NetR43_2: R43.2 R44.1
NetR46_1: R46.1 R49.2(Punto_medio) R49.3(Right) U5.7(OUT)
NetR49_1: R49.1(Left) R50.2 U5.6(-)

### Library data of the parts
C61 C63 C66 = Capacitor: as C15 on sheet usb_2_0
R38-R48 R50 = Resistor: Resistencia
R49 = Potenciometer: Link: *; Fabricante: *
U5 = Opamp_x2: Integrado con 2 operacionales
C62 C64 C65 C67 = Capacitor polarizado: Link: *; Fabricante: *
CN3 = jack_3.5mm: Cod. Proveedor: *; Encapsulado: *; Link: *; Proveedor: *; Fabricante: *

## Sheet input.SchDoc
size A4
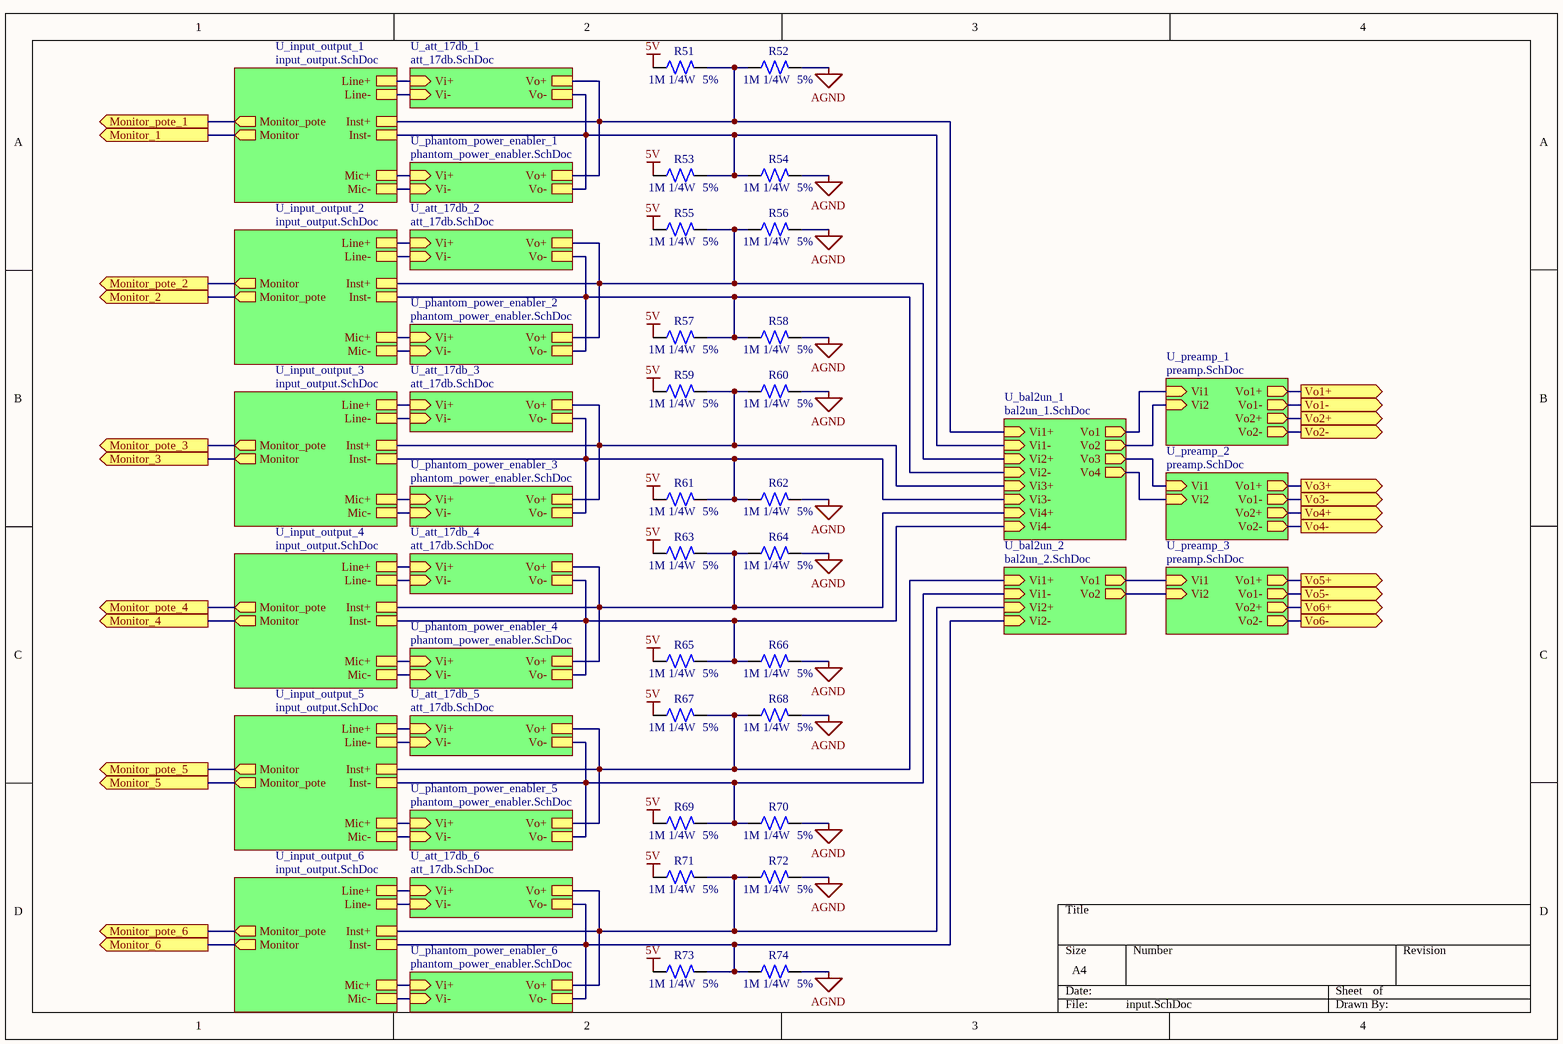
[diagram p7: input.SchDoc]

### Parts
R51  Valor: 1M  Potencia: 1/4W  Tolerancia: 5%  [R0805]  (hidden comment: Resistor)
R52  Valor: 1M  Potencia: 1/4W  Tolerancia: 5%  [R0805]  (hidden comment: Resistor)
R53  Valor: 1M  Potencia: 1/4W  Tolerancia: 5%  [R0805]  (hidden comment: Resistor)
R54  Valor: 1M  Potencia: 1/4W  Tolerancia: 5%  [R0805]  (hidden comment: Resistor)
R55  Valor: 1M  Potencia: 1/4W  Tolerancia: 5%  [R0805]  (hidden comment: Resistor)
R56  Valor: 1M  Potencia: 1/4W  Tolerancia: 5%  [R0805]  (hidden comment: Resistor)
R57  Valor: 1M  Potencia: 1/4W  Tolerancia: 5%  [R0805]  (hidden comment: Resistor)
R58  Valor: 1M  Potencia: 1/4W  Tolerancia: 5%  [R0805]  (hidden comment: Resistor)
R59  Valor: 1M  Potencia: 1/4W  Tolerancia: 5%  [R0805]  (hidden comment: Resistor)
R60  Valor: 1M  Potencia: 1/4W  Tolerancia: 5%  [R0805]  (hidden comment: Resistor)
R61  Valor: 1M  Potencia: 1/4W  Tolerancia: 5%  [R0805]  (hidden comment: Resistor)
R62  Valor: 1M  Potencia: 1/4W  Tolerancia: 5%  [R0805]  (hidden comment: Resistor)
R63  Valor: 1M  Potencia: 1/4W  Tolerancia: 5%  [R0805]  (hidden comment: Resistor)
R64  Valor: 1M  Potencia: 1/4W  Tolerancia: 5%  [R0805]  (hidden comment: Resistor)
R65  Valor: 1M  Potencia: 1/4W  Tolerancia: 5%  [R0805]  (hidden comment: Resistor)
R66  Valor: 1M  Potencia: 1/4W  Tolerancia: 5%  [R0805]  (hidden comment: Resistor)
R67  Valor: 1M  Potencia: 1/4W  Tolerancia: 5%  [R0805]  (hidden comment: Resistor)
R68  Valor: 1M  Potencia: 1/4W  Tolerancia: 5%  [R0805]  (hidden comment: Resistor)
R69  Valor: 1M  Potencia: 1/4W  Tolerancia: 5%  [R0805]  (hidden comment: Resistor)
R70  Valor: 1M  Potencia: 1/4W  Tolerancia: 5%  [R0805]  (hidden comment: Resistor)
R71  Valor: 1M  Potencia: 1/4W  Tolerancia: 5%  [R0805]  (hidden comment: Resistor)
R72  Valor: 1M  Potencia: 1/4W  Tolerancia: 5%  [R0805]  (hidden comment: Resistor)
R73  Valor: 1M  Potencia: 1/4W  Tolerancia: 5%  [R0805]  (hidden comment: Resistor)
R74  Valor: 1M  Potencia: 1/4W  Tolerancia: 5%  [R0805]  (hidden comment: Resistor)

### Sub-sheets
U_att_17db_1 = att_17db.SchDoc: Vi+ (in), Vi- (in), Vo-, Vo+
U_att_17db_2 = att_17db.SchDoc: Vi+ (in), Vi- (in), Vo-, Vo+
U_att_17db_3 = att_17db.SchDoc: Vi+ (in), Vi- (in), Vo-, Vo+
U_att_17db_4 = att_17db.SchDoc: Vi+ (in), Vi- (in), Vo-, Vo+
U_att_17db_5 = att_17db.SchDoc: Vi+ (in), Vi- (in), Vo-, Vo+
U_att_17db_6 = att_17db.SchDoc: Vi+ (in), Vi- (in), Vo-, Vo+
U_bal2un_1 = bal2un_1.SchDoc: Vi2+ (in), Vi2- (in), Vo2 (out), Vi3+ (in), Vi3- (in), Vo1 (out), Vi4+ (in), Vi4- (in), Vo3 (out), Vi1+ (in), Vi1- (in), Vo4 (out)
U_bal2un_2 = bal2un_2.SchDoc: Vi2+ (in), Vi2- (in), Vo2 (out), Vi1+ (in), Vi1- (in), Vo1 (out)
U_input_output_1 = input_output.SchDoc: Mic-, Inst-, Mic+, Line-, Line+, Inst+, Monitor_pote (out), Monitor (out)
U_input_output_2 = input_output.SchDoc: Mic-, Inst-, Mic+, Line-, Line+, Inst+, Monitor (out), Monitor_pote (out)
U_input_output_3 = input_output.SchDoc: Mic-, Inst-, Mic+, Line-, Line+, Inst+, Monitor_pote (out), Monitor (out)
U_input_output_4 = input_output.SchDoc: Mic-, Inst-, Mic+, Line-, Line+, Inst+, Monitor_pote (out), Monitor (out)
U_input_output_5 = input_output.SchDoc: Mic-, Inst-, Mic+, Line-, Line+, Inst+, Monitor (out), Monitor_pote (out)
U_input_output_6 = input_output.SchDoc: Mic-, Inst-, Mic+, Line-, Line+, Inst+, Monitor_pote (out), Monitor (out)
U_phantom_power_enabler_1 = phantom_power_enabler.SchDoc: Vi+ (in), Vi- (in), Vo+, Vo-
U_phantom_power_enabler_2 = phantom_power_enabler.SchDoc: Vi+ (in), Vi- (in), Vo+, Vo-
U_phantom_power_enabler_3 = phantom_power_enabler.SchDoc: Vi+ (in), Vi- (in), Vo+, Vo-
U_phantom_power_enabler_4 = phantom_power_enabler.SchDoc: Vi+ (in), Vi- (in), Vo+, Vo-
U_phantom_power_enabler_5 = phantom_power_enabler.SchDoc: Vi+ (in), Vi- (in), Vo+, Vo-
U_phantom_power_enabler_6 = phantom_power_enabler.SchDoc: Vi+ (in), Vi- (in), Vo+, Vo-
U_preamp_1 = preamp.SchDoc: Vi2 (in), Vi1 (in), Vo1+ (out), Vo2- (out), Vo2+ (out), Vo1- (out)
U_preamp_2 = preamp.SchDoc: Vi2 (in), Vi1 (in), Vo1+ (out), Vo2- (out), Vo2+ (out), Vo1- (out)
U_preamp_3 = preamp.SchDoc: Vi2 (in), Vi1 (in), Vo1+ (out), Vo2- (out), Vo2+ (out), Vo1- (out)

### Ports
Monitor_1 (out), Monitor_2 (out), Monitor_3 (out), Monitor_4 (out), Monitor_5 (out), Monitor_6 (out), Monitor_pote_1 (out), Monitor_pote_2 (out), Monitor_pote_3 (out), Monitor_pote_4 (out), Monitor_pote_5 (out), Monitor_pote_6 (out), Vo1+ (out), Vo1- (out), Vo2+ (out), Vo2- (out), Vo3+ (out), Vo3- (out), Vo4+ (out), Vo4- (out), Vo5+ (out), Vo5- (out), Vo6+ (out), Vo6- (out)

### Nets
5V: R51.1 R53.1 R55.1 R57.1 R59.1 R61.1 R63.1 R65.1 R67.1 R69.1 R71.1 R73.1
AGND: R52.2 R54.2 R56.2 R58.2 R60.2 R62.2 R64.2 R66.2 R68.2 R70.2 R72.2 R74.2
NetC16_1_2: sheet U_input_output_1/Line+, sheet U_att_17db_1/Vi+
NetC16_2_2: sheet U_input_output_2/Line+, sheet U_att_17db_2/Vi+
NetC16_3_2: sheet U_input_output_3/Line+, sheet U_att_17db_3/Vi+
NetC16_4_2: sheet U_input_output_4/Line+, sheet U_att_17db_4/Vi+
NetC16_5_2: sheet U_input_output_5/Line+, sheet U_att_17db_5/Vi+
NetC16_6_2: sheet U_input_output_6/Line+, sheet U_att_17db_6/Vi+
NetC17_1_1: R51.2 R52.1 ; sheet U_input_output_1/Inst+, sheet U_att_17db_1/Vo+, sheet U_bal2un_1/Vi1+, sheet U_phantom_power_enabler_1/Vo+
NetC17_1_2: R53.2 R54.1 ; sheet U_input_output_1/Inst-, sheet U_att_17db_1/Vo-, sheet U_bal2un_1/Vi1-, sheet U_phantom_power_enabler_1/Vo-
NetC17_2_1: R55.2 R56.1 ; sheet U_bal2un_1/Vi2+, sheet U_input_output_2/Inst+, sheet U_att_17db_2/Vo+, sheet U_phantom_power_enabler_2/Vo+
NetC17_2_2: R57.2 R58.1 ; sheet U_bal2un_1/Vi2-, sheet U_input_output_2/Inst-, sheet U_att_17db_2/Vo-, sheet U_phantom_power_enabler_2/Vo-
NetC17_3_1: R59.2 R60.1 ; sheet U_bal2un_1/Vi3+, sheet U_input_output_3/Inst+, sheet U_att_17db_3/Vo+, sheet U_phantom_power_enabler_3/Vo+
NetC17_3_2: R61.2 R62.1 ; sheet U_bal2un_1/Vi3-, sheet U_input_output_3/Inst-, sheet U_att_17db_3/Vo-, sheet U_phantom_power_enabler_3/Vo-
NetC17_4_1: R63.2 R64.1 ; sheet U_bal2un_1/Vi4+, sheet U_input_output_4/Inst+, sheet U_att_17db_4/Vo+, sheet U_phantom_power_enabler_4/Vo+
NetC17_4_2: R65.2 R66.1 ; sheet U_bal2un_1/Vi4-, sheet U_input_output_4/Inst-, sheet U_att_17db_4/Vo-, sheet U_phantom_power_enabler_4/Vo-
NetC17_5_1: R67.2 R68.1 ; sheet U_bal2un_2/Vi1+, sheet U_input_output_5/Inst+, sheet U_att_17db_5/Vo+, sheet U_phantom_power_enabler_5/Vo+
NetC17_5_2: R69.2 R70.1 ; sheet U_bal2un_2/Vi1-, sheet U_input_output_5/Inst-, sheet U_att_17db_5/Vo-, sheet U_phantom_power_enabler_5/Vo-
NetC17_6_1: R71.2 R72.1 ; sheet U_bal2un_2/Vi2+, sheet U_input_output_6/Inst+, sheet U_att_17db_6/Vo+, sheet U_phantom_power_enabler_6/Vo+
NetC17_6_2: R73.2 R74.1 ; sheet U_bal2un_2/Vi2-, sheet U_input_output_6/Inst-, sheet U_att_17db_6/Vo-, sheet U_phantom_power_enabler_6/Vo-
NetC18_1_2: sheet U_input_output_1/Line-, sheet U_att_17db_1/Vi-
NetC18_2_2: sheet U_input_output_2/Line-, sheet U_att_17db_2/Vi-
NetC18_3_2: sheet U_input_output_3/Line-, sheet U_att_17db_3/Vi-
NetC18_4_2: sheet U_input_output_4/Line-, sheet U_att_17db_4/Vi-
NetC18_5_2: sheet U_input_output_5/Line-, sheet U_att_17db_5/Vi-
NetC18_6_2: sheet U_input_output_6/Line-, sheet U_att_17db_6/Vi-
NetC33_1: port Vo1+, sheet U_preamp_1/Vo1+
NetC34_1: port Vo1-, sheet U_preamp_1/Vo1-
NetC37_1: port Vo2+, sheet U_preamp_1/Vo2+
NetC38_1: port Vo2-, sheet U_preamp_1/Vo2-
NetC39_1: port Vo3+, sheet U_preamp_2/Vo1+
NetC40_1: port Vo3-, sheet U_preamp_2/Vo1-
NetC41_1: port Vo4+, sheet U_preamp_2/Vo2+
NetC42_1: port Vo4-, sheet U_preamp_2/Vo2-
NetC43_1: port Vo5+, sheet U_preamp_3/Vo1+
NetC44_1: port Vo5-, sheet U_preamp_3/Vo1-
NetC45_1: port Vo6+, sheet U_preamp_3/Vo2+
NetC46_1: port Vo6-, sheet U_preamp_3/Vo2-
NetC49_1_1: port Monitor_pote_1, sheet U_input_output_1/Monitor_pote
NetC49_2_1: port Monitor_2, sheet U_input_output_2/Monitor_pote
NetC49_3_1: port Monitor_pote_3, sheet U_input_output_3/Monitor_pote
NetC49_4_1: port Monitor_pote_4, sheet U_input_output_4/Monitor_pote
NetC49_5_1: port Monitor_5, sheet U_input_output_5/Monitor_pote
NetC49_6_1: port Monitor_pote_6, sheet U_input_output_6/Monitor_pote
NetC50_1_1: port Monitor_1, sheet U_input_output_1/Monitor
NetC50_2_1: port Monitor_pote_2, sheet U_input_output_2/Monitor
NetC50_3_1: port Monitor_3, sheet U_input_output_3/Monitor
NetC50_4_1: port Monitor_4, sheet U_input_output_4/Monitor
NetC50_5_1: port Monitor_pote_5, sheet U_input_output_5/Monitor
NetC50_6_1: port Monitor_6, sheet U_input_output_6/Monitor
NetC57_1_2: sheet U_preamp_1/Vi1, sheet U_bal2un_1/Vo1
NetC57_2_2: sheet U_preamp_2/Vi1, sheet U_bal2un_1/Vo3
NetC57_3_2: sheet U_bal2un_2/Vo1, sheet U_preamp_3/Vi1
NetC58_1_2: sheet U_preamp_1/Vi2, sheet U_bal2un_1/Vo2
NetC58_2_2: sheet U_preamp_2/Vi2, sheet U_bal2un_1/Vo4
NetC58_3_2: sheet U_bal2un_2/Vo2, sheet U_preamp_3/Vi2
NetC89_1_1: sheet U_input_output_1/Mic+, sheet U_phantom_power_enabler_1/Vi+
NetC89_2_1: sheet U_input_output_2/Mic+, sheet U_phantom_power_enabler_2/Vi+
NetC89_3_1: sheet U_input_output_3/Mic+, sheet U_phantom_power_enabler_3/Vi+
NetC89_4_1: sheet U_input_output_4/Mic+, sheet U_phantom_power_enabler_4/Vi+
NetC89_5_1: sheet U_input_output_5/Mic+, sheet U_phantom_power_enabler_5/Vi+
NetC89_6_1: sheet U_input_output_6/Mic+, sheet U_phantom_power_enabler_6/Vi+
NetC92_1_2: sheet U_input_output_1/Mic-, sheet U_phantom_power_enabler_1/Vi-
NetC92_2_2: sheet U_input_output_2/Mic-, sheet U_phantom_power_enabler_2/Vi-
NetC92_3_2: sheet U_input_output_3/Mic-, sheet U_phantom_power_enabler_3/Vi-
NetC92_4_2: sheet U_input_output_4/Mic-, sheet U_phantom_power_enabler_4/Vi-
NetC92_5_2: sheet U_input_output_5/Mic-, sheet U_phantom_power_enabler_5/Vi-
NetC92_6_2: sheet U_input_output_6/Mic-, sheet U_phantom_power_enabler_6/Vi-

### Library data of the parts
R51-R74 = Resistor: Resistencia

## Sheet input_output.SchDoc
size A4
Used 6 times, as channels U_input/U_input_output_1, U_input/U_input_output_2, U_input/U_input_output_3, U_input/U_input_output_4, U_input/U_input_output_5, U_input/U_input_output_6. Parts and nets are listed once, with the designators drawn on the sheet.
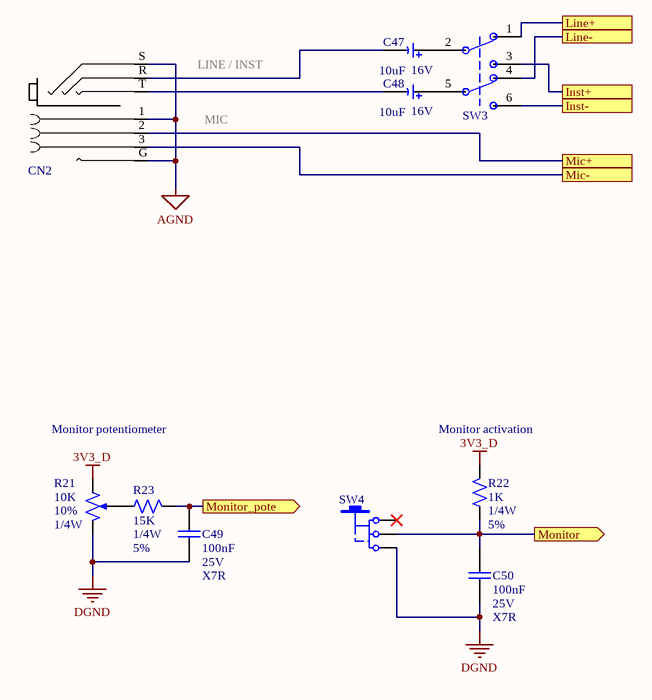
[diagram p8: input_output.SchDoc]

### Parts
C47  Valor: 10uF  tension: 16V  [CAP_Electrolytic]  (hidden comment: Capacitor polarizado)
C48  Valor: 10uF  tension: 16V  [CAP_Electrolytic]  (hidden comment: Capacitor polarizado)
C49  Valor: 100nF  tension: 25V  tolerancia: X7R  [C0805]  (hidden comment: Capacitor)
C50  Valor: 100nF  tension: 25V  tolerancia: X7R  [C0805]  (hidden comment: Capacitor)
CN2  XRL_Jack_Combo_stereo  [Combo XLR Jack]  (value not drawn)
R21  valor: 10K  Tolerancia: 10%  Potencia: 1/4W  [Header 3x1]  (hidden comment: Potenciometro)
R22  Valor: 1K  Potencia: 1/4W  Tolerancia: 5%  [R0805]  (hidden comment: Resistor)
R23  Valor: 15K  Potencia: 1/4W  Tolerancia: 5%  [R0805]  (hidden comment: Resistor)
SW3  Slide_SW_DPDT  [DPDT_SMD_Slide_90º]  (value not drawn)
SW4  TAC_SWITCH_4  [SPDT_SMD_90º]  (value not drawn)

### Ports
Inst+, Inst-, Line+, Line-, Mic+, Mic-, Monitor (out), Monitor_pote (out)

### Nets
3V3_D: R21.3(Right) R22.2
AGND: CN2.1 CN2.G CN2.S
DGND: C49.2 C50.2 R21.1(Left) SW4.3
Inst+: SW3.3 ; port Inst+
Inst-: SW3.6 ; port Inst-
Line+: SW3.1 ; port Line+
Line-: SW3.4 ; port Line-
Mic+: CN2.2 ; port Mic+
Mic-: CN2.3 ; port Mic-
Monitor: C50.1 R22.1 SW4.2 ; port Monitor
Monitor_pote: C49.1 R23.2 ; port Monitor_pote
NetC47_1: C47.1 SW3.2
NetC47_2: C47.2 CN2.R
NetC48_1: C48.1 SW3.5
NetC48_2: C48.2 CN2.T
NetR21_2: R21.2(Punto_medio) R23.1

Not connected (* = marked no-connect by the designer): SW4 1*

### Channels
U_input/U_input_output_1: designators end in _1; ports Inst+=NetC17_1_1 Inst-=NetC17_1_2 Line+=NetC16_1_2 Line-=NetC18_1_2 Mic+=NetC89_1_1 Mic-=NetC92_1_2 Monitor=NetC50_1_1 Monitor_pote=NetC49_1_1
U_input/U_input_output_2: designators end in _2; ports Inst+=NetC17_2_1 Inst-=NetC17_2_2 Line+=NetC16_2_2 Line-=NetC18_2_2 Mic+=NetC89_2_1 Mic-=NetC92_2_2 Monitor=NetC50_2_1 Monitor_pote=NetC49_2_1
U_input/U_input_output_3: designators end in _3; ports Inst+=NetC17_3_1 Inst-=NetC17_3_2 Line+=NetC16_3_2 Line-=NetC18_3_2 Mic+=NetC89_3_1 Mic-=NetC92_3_2 Monitor=NetC50_3_1 Monitor_pote=NetC49_3_1
U_input/U_input_output_4: designators end in _4; ports Inst+=NetC17_4_1 Inst-=NetC17_4_2 Line+=NetC16_4_2 Line-=NetC18_4_2 Mic+=NetC89_4_1 Mic-=NetC92_4_2 Monitor=NetC50_4_1 Monitor_pote=NetC49_4_1
U_input/U_input_output_5: designators end in _5; ports Inst+=NetC17_5_1 Inst-=NetC17_5_2 Line+=NetC16_5_2 Line-=NetC18_5_2 Mic+=NetC89_5_1 Mic-=NetC92_5_2 Monitor=NetC50_5_1 Monitor_pote=NetC49_5_1
U_input/U_input_output_6: designators end in _6; ports Inst+=NetC17_6_1 Inst-=NetC17_6_2 Line+=NetC16_6_2 Line-=NetC18_6_2 Mic+=NetC89_6_1 Mic-=NetC92_6_2 Monitor=NetC50_6_1 Monitor_pote=NetC49_6_1

### Notes on the sheet
- LINE / INST
- MIC
- Monitor potentiometer
- (near R22) Monitor activation

### Library data of the parts
C49 C50 = Capacitor: as C15 on sheet usb_2_0; Link: *; Fabricante: *
R21 = Potenciometer: Link: *; Fabricante: *
R22 R23 = Resistor: Resistencia; Fabricante: *
SW3 = Slide_SW_DPDT: Cod. Proveedor: CKN10722TR-ND; Proveedor: Digi-Key; Encapsulado: SMD; Fabricante: C&K; Link: https://www.digikey.com/product-detail/en/c-k/JS202011JAQN/CKN10722TR-ND/6137629
SW4 = SWITCH_3: Pulsador de 4 pines; Proveedor: Digi-Key; Cod. Proveedor: 563-1246-1-ND; Encapsulado: SMD; Fabricante: Nidec Copal Electronics; Link: https://www.digikey.com/product-detail/en/nidec-copal-electronics/CFPA-1FB4-A2T/563-1246-1-ND/2357767
C47 C48 = Capacitor polarizado: Link: *; Fabricante: *
CN2 = XRL_Jack_Combo_stereo: Cod. Proveedor: *; Encapsulado: *; Proveedor: *; Link: *; Fabricante: *

## Sheet att_17db.SchDoc
size A4
Used 6 times, as channels U_input/U_att_17db_1, U_input/U_att_17db_2, U_input/U_att_17db_3, U_input/U_att_17db_4, U_input/U_att_17db_5, U_input/U_att_17db_6. Parts and nets are listed once, with the designators drawn on the sheet.
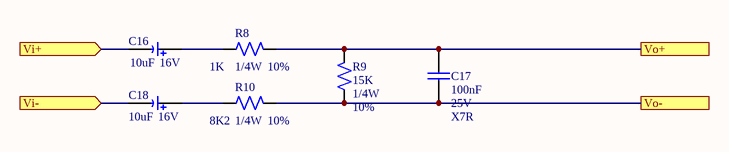
[diagram p9: att_17db.SchDoc]

### Parts
C16  Valor: 10uF  tension: 16V  [CAP_Electrolytic]  (hidden comment: Capacitor polarizado)
C17  valor: 100nF  tension: 25V  tolerancia: X7R  [C0805]  (hidden comment: Capacitor)
C18  Valor: 10uF  tension: 16V  [CAP_Electrolytic]  (hidden comment: Capacitor polarizado)
R8  Valor: 1K  Potencia: 1/4W  Tolerancia: 10%  [R0805]  (hidden comment: Resistor)
R9  Valor: 15K  Potencia: 1/4W  Tolerancia: 10%  [R0805]  (hidden comment: Resistor)
R10  Valor: 8K2  Potencia: 1/4W  Tolerancia: 10%  [R0805]  (hidden comment: Resistor)

### Ports
Vi+ (in), Vi- (in), Vo+, Vo-

### Nets
Vi+: C16.2 ; port Vi+
Vi-: C18.2 ; port Vi-
Vo+: C17.1 R8.2 R9.2 ; port Vo+
Vo-: C17.2 R9.1 R10.2 ; port Vo-
NetC16_1: C16.1 R8.1
NetC18_1: C18.1 R10.1

### Channels
U_input/U_att_17db_1: designators end in _1; ports Vi+=NetC16_1_2 Vi-=NetC18_1_2 Vo+=NetC17_1_1 Vo-=NetC17_1_2
U_input/U_att_17db_2: designators end in _2; ports Vi+=NetC16_2_2 Vi-=NetC18_2_2 Vo+=NetC17_2_1 Vo-=NetC17_2_2
U_input/U_att_17db_3: designators end in _3; ports Vi+=NetC16_3_2 Vi-=NetC18_3_2 Vo+=NetC17_3_1 Vo-=NetC17_3_2
U_input/U_att_17db_4: designators end in _4; ports Vi+=NetC16_4_2 Vi-=NetC18_4_2 Vo+=NetC17_4_1 Vo-=NetC17_4_2
U_input/U_att_17db_5: designators end in _5; ports Vi+=NetC16_5_2 Vi-=NetC18_5_2 Vo+=NetC17_5_1 Vo-=NetC17_5_2
U_input/U_att_17db_6: designators end in _6; ports Vi+=NetC16_6_2 Vi-=NetC18_6_2 Vo+=NetC17_6_1 Vo-=NetC17_6_2

### Library data of the parts
C17 = Capacitor: as C15 on sheet usb_2_0
R8-R10 = Resistor: Resistencia
C16 C18 = Capacitor polarizado: Link: *; Fabricante: *

## Sheet preamp.SchDoc
size A4
Used 3 times, as channels U_input/U_preamp_1, U_input/U_preamp_2, U_input/U_preamp_3. Parts and nets are listed once, with the designators drawn on the sheet.
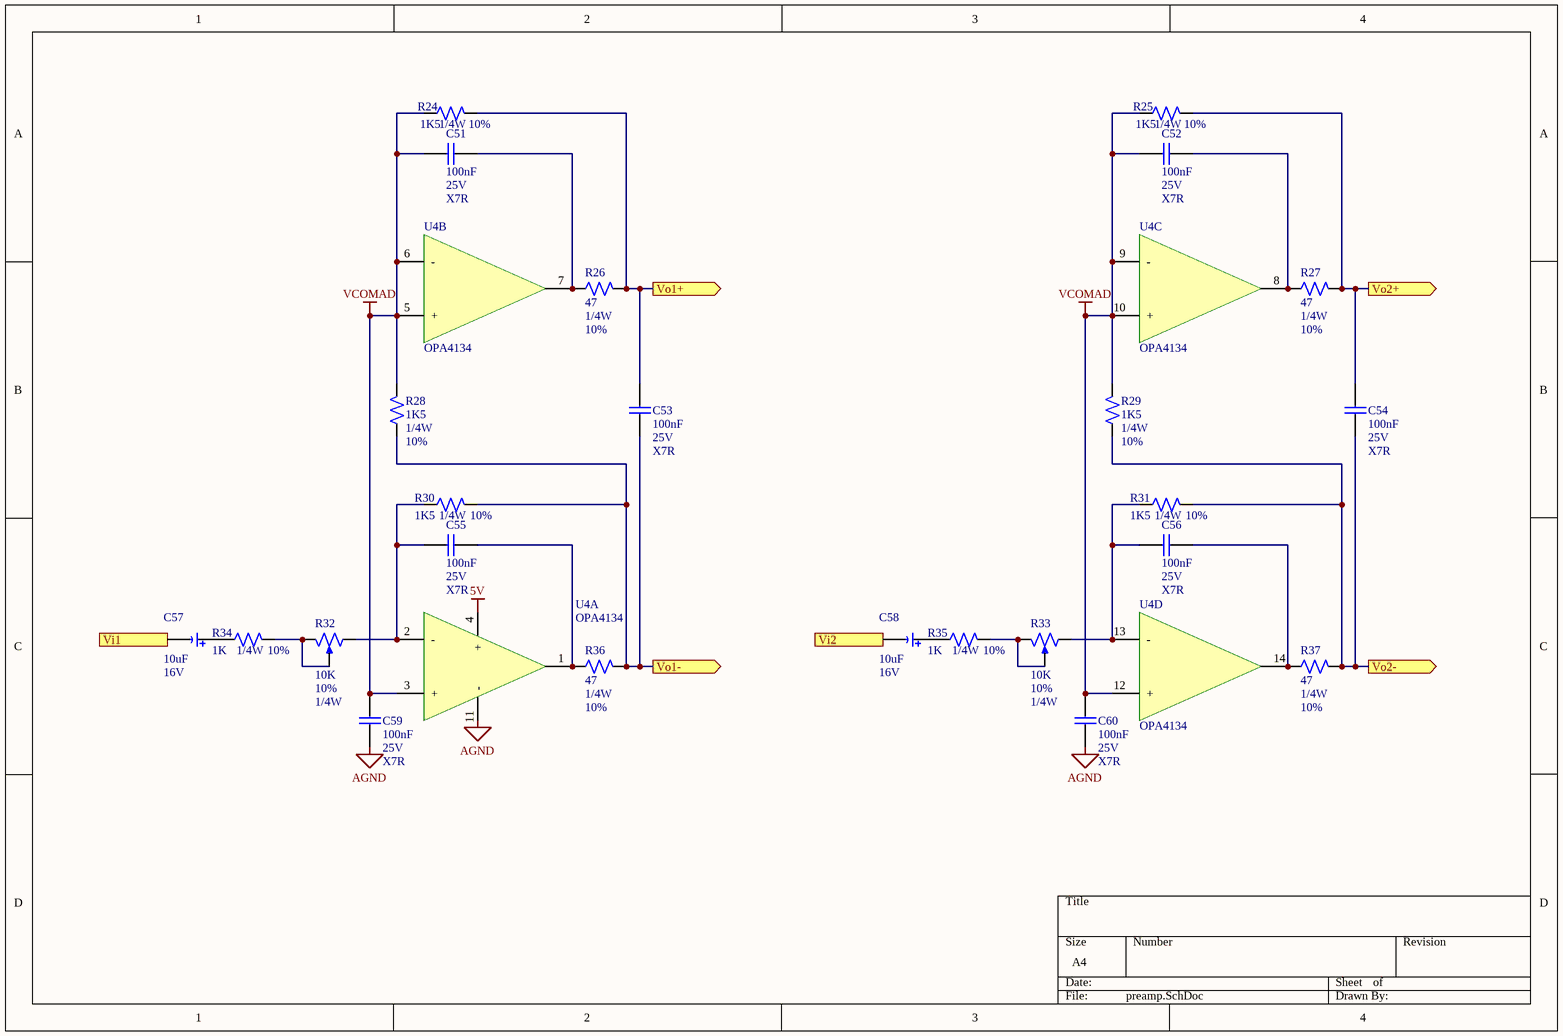
[diagram p10: preamp.SchDoc]

### Parts
C51  valor: 100nF  tension: 25V  tolerancia: X7R  [C0805]  (hidden comment: Capacitor)
C52  valor: 100nF  tension: 25V  tolerancia: X7R  [C0805]  (hidden comment: Capacitor)
C53  valor: 100nF  tension: 25V  tolerancia: X7R  [C0805]  (hidden comment: Capacitor)
C54  valor: 100nF  tension: 25V  tolerancia: X7R  [C0805]  (hidden comment: Capacitor)
C55  valor: 100nF  tension: 25V  tolerancia: X7R  [C0805]  (hidden comment: Capacitor)
C56  valor: 100nF  tension: 25V  tolerancia: X7R  [C0805]  (hidden comment: Capacitor)
C57  Valor: 10uF  tension: 16V  [CAP_Electrolytic]  (hidden comment: Capacitor polarizado)
C58  Valor: 10uF  tension: 16V  [CAP_Electrolytic]  (hidden comment: Capacitor polarizado)
C59  valor: 100nF  tension: 25V  tolerancia: X7R  [C0805]  (hidden comment: Capacitor)
C60  valor: 100nF  tension: 25V  tolerancia: X7R  [C0805]  (hidden comment: Capacitor)
R24  Valor: 1K5  Potencia: 1/4W  Tolerancia: 10%  [R0805]  (hidden comment: Resistor)
R25  Valor: 1K5  Potencia: 1/4W  Tolerancia: 10%  [R0805]  (hidden comment: Resistor)
R26  Valor: 47  Potencia: 1/4W  Tolerancia: 10%  [R0805]  (hidden comment: Resistor)
R27  Valor: 47  Potencia: 1/4W  Tolerancia: 10%  [R0805]  (hidden comment: Resistor)
R28  Valor: 1K5  Potencia: 1/4W  Tolerancia: 10%  [R0805]  (hidden comment: Resistor)
R29  Valor: 1K5  Potencia: 1/4W  Tolerancia: 10%  [R0805]  (hidden comment: Resistor)
R30  Valor: 1K5  Potencia: 1/4W  Tolerancia: 10%  [R0805]  (hidden comment: Resistor)
R31  Valor: 1K5  Potencia: 1/4W  Tolerancia: 10%  [R0805]  (hidden comment: Resistor)
R32  valor: 10K  Tolerancia: 10%  Potencia: 1/4W  [Header 3x1]  (hidden comment: Potenciometro)
R33  valor: 10K  Tolerancia: 10%  Potencia: 1/4W  [Header 3x1]  (hidden comment: Potenciometro)
R34  Valor: 1K  Potencia: 1/4W  Tolerancia: 10%  [R0805]  (hidden comment: Resistor)
R35  Valor: 1K  Potencia: 1/4W  Tolerancia: 10%  [R0805]  (hidden comment: Resistor)
R36  Valor: 47  Potencia: 1/4W  Tolerancia: 10%  [R0805]  (hidden comment: Resistor)
R37  Valor: 47  Potencia: 1/4W  Tolerancia: 10%  [R0805]  (hidden comment: Resistor)
U4  OPA4134  [TSSOP-14]  (parts A,B,C,D of 4)

### Ports
Vi1 (in), Vi2 (in), Vo1+ (out), Vo1- (out), Vo2+ (out), Vo2- (out)

### Nets
5V: U4.4(+)
AGND: C59.2 C60.2 U4.11(-)
VCOMAD: C51.2 C52.2 C59.1 C60.1 R24.1 R25.1 R28.2 R29.2 U4.3(+) U4.5(+) U4.6(-) U4.9(-) U4.10(+) U4.12(+)
Vi1: C57.2 ; port Vi1
Vi2: C58.2 ; port Vi2
Vo1+: C53.1 R24.2 R26.2 ; port Vo1+
Vo1-: C53.2 R28.1 R30.2 R36.2 ; port Vo1-
Vo2+: C54.1 R25.2 R27.2 ; port Vo2+
Vo2-: C54.2 R29.1 R31.2 R37.2 ; port Vo2-
NetC51_1: C51.1 R26.1 U4.7(OUT)
NetC52_1: C52.1 R27.1 U4.8(OUT)
NetC55_1: C55.1 R36.1 U4.1(OUT)
NetC55_2: C55.2 R30.1 R32.3(Right) U4.2(-)
NetC56_1: C56.1 R37.1 U4.14(OUT)
NetC56_2: C56.2 R31.1 R33.3(Right) U4.13(-)
NetC57_1: C57.1 R34.1
NetC58_1: C58.1 R35.1
NetR32_1: R32.1(Left) R32.2(Punto_medio) R34.2
NetR33_1: R33.1(Left) R33.2(Punto_medio) R35.2

### Channels
U_input/U_preamp_1: designators end in _1; ports Vi1=NetC57_1_2 Vi2=NetC58_1_2 Vo1+=NetC33_1 Vo1-=NetC34_1 Vo2+=NetC37_1 Vo2-=NetC38_1
U_input/U_preamp_2: designators end in _2; ports Vi1=NetC57_2_2 Vi2=NetC58_2_2 Vo1+=NetC39_1 Vo1-=NetC40_1 Vo2+=NetC41_1 Vo2-=NetC42_1
U_input/U_preamp_3: designators end in _3; ports Vi1=NetC57_3_2 Vi2=NetC58_3_2 Vo1+=NetC43_1 Vo1-=NetC44_1 Vo2+=NetC45_1 Vo2-=NetC46_1

### Library data of the parts
C51-C56 C59 C60 = Capacitor: as C15 on sheet usb_2_0
R24-R31 R34-R37 = Resistor: Resistencia
R32 R33 = Potenciometer: Link: *; Fabricante: *
U4 = Opamp_x4: Integrado con 4 operacionales; Cod. Proveedor: 296-22024-1-ND; Proveedor: Digi-Key; Encapsulado: 8-SOIC; Fabricante: Texas Instruments; Link: https://www.digikey.com/product-detail/es/OPA2134UA-2K5/296-22024-1-ND/301154?utm_campaign=buynow&WT.z_cid=ref_octopart_dkc_buynow&utm_medium=aggregator&curr=usd&site=us&utm_source=octopart
C57 C58 = Capacitor polarizado: Link: *; Fabricante: *

## Sheet bal2un_2.SchDoc
size A4
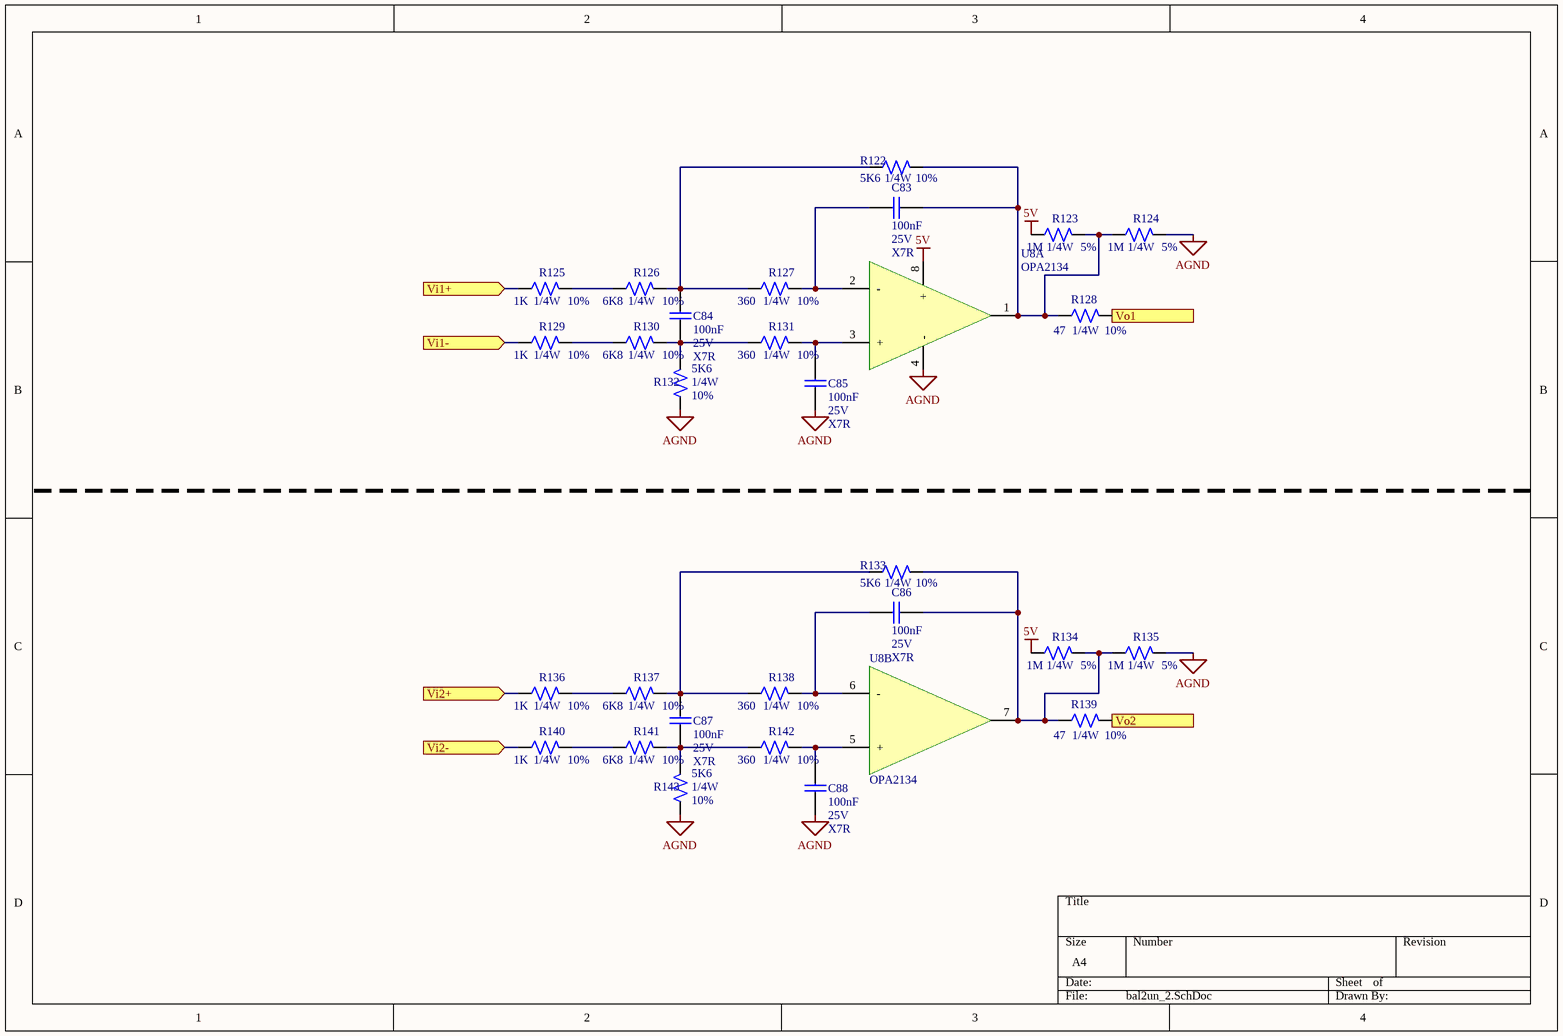
[diagram p11: bal2un_2.SchDoc]

### Parts
C83  valor: 100nF  tension: 25V  tolerancia: X7R  [C0805]  (hidden comment: Capacitor)
C84  valor: 100nF  tension: 25V  tolerancia: X7R  [C0805]  (hidden comment: Capacitor)
C85  valor: 100nF  tension: 25V  tolerancia: X7R  [C0805]  (hidden comment: Capacitor)
C86  valor: 100nF  tension: 25V  tolerancia: X7R  [C0805]  (hidden comment: Capacitor)
C87  valor: 100nF  tension: 25V  tolerancia: X7R  [C0805]  (hidden comment: Capacitor)
C88  valor: 100nF  tension: 25V  tolerancia: X7R  [C0805]  (hidden comment: Capacitor)
R122  Valor: 5K6  Potencia: 1/4W  Tolerancia: 10%  [R0805]  (hidden comment: Resistor)
R123  Valor: 1M  Potencia: 1/4W  Tolerancia: 5%  [R0805]  (hidden comment: Resistor)
R124  Valor: 1M  Potencia: 1/4W  Tolerancia: 5%  [R0805]  (hidden comment: Resistor)
R125  Valor: 1K  Potencia: 1/4W  Tolerancia: 10%  [R0805]  (hidden comment: Resistor)
R126  Valor: 6K8  Potencia: 1/4W  Tolerancia: 10%  [R0805]  (hidden comment: Resistor)
R127  Valor: 360  Potencia: 1/4W  Tolerancia: 10%  [R0805]  (hidden comment: Resistor)
R128  Valor: 47  Potencia: 1/4W  Tolerancia: 10%  [R0805]  (hidden comment: Resistor)
R129  Valor: 1K  Potencia: 1/4W  Tolerancia: 10%  [R0805]  (hidden comment: Resistor)
R130  Valor: 6K8  Potencia: 1/4W  Tolerancia: 10%  [R0805]  (hidden comment: Resistor)
R131  Valor: 360  Potencia: 1/4W  Tolerancia: 10%  [R0805]  (hidden comment: Resistor)
R132  Valor: 5K6  Potencia: 1/4W  Tolerancia: 10%  [R0805]  (hidden comment: Resistor)
R133  Valor: 5K6  Potencia: 1/4W  Tolerancia: 10%  [R0805]  (hidden comment: Resistor)
R134  Valor: 1M  Potencia: 1/4W  Tolerancia: 5%  [R0805]  (hidden comment: Resistor)
R135  Valor: 1M  Potencia: 1/4W  Tolerancia: 5%  [R0805]  (hidden comment: Resistor)
R136  Valor: 1K  Potencia: 1/4W  Tolerancia: 10%  [R0805]  (hidden comment: Resistor)
R137  Valor: 6K8  Potencia: 1/4W  Tolerancia: 10%  [R0805]  (hidden comment: Resistor)
R138  Valor: 360  Potencia: 1/4W  Tolerancia: 10%  [R0805]  (hidden comment: Resistor)
R139  Valor: 47  Potencia: 1/4W  Tolerancia: 10%  [R0805]  (hidden comment: Resistor)
R140  Valor: 1K  Potencia: 1/4W  Tolerancia: 10%  [R0805]  (hidden comment: Resistor)
R141  Valor: 6K8  Potencia: 1/4W  Tolerancia: 10%  [R0805]  (hidden comment: Resistor)
R142  Valor: 360  Potencia: 1/4W  Tolerancia: 10%  [R0805]  (hidden comment: Resistor)
R143  Valor: 5K6  Potencia: 1/4W  Tolerancia: 10%  [R0805]  (hidden comment: Resistor)
U8  OPA2134  [D8]  (parts A,B of 2)

### Ports
Vi1+ (in), Vi1- (in), Vi2+ (in), Vi2- (in), Vo1 (out), Vo2 (out)

### Nets
5V: R123.1 R134.1 U8.8(+)
AGND: C85.2 C88.2 R124.2 R132.1 R135.2 R143.1 U8.4(-)
NetC17_5_1: R125.1 ; port Vi1+
NetC17_5_2: R129.1 ; port Vi1-
NetC17_6_1: R136.1 ; port Vi2+
NetC17_6_2: R140.1 ; port Vi2-
NetC57_3_2: R128.2 ; port Vo1
NetC58_3_2: R139.2 ; port Vo2
NetC83_1: C83.1 R122.2 R123.2 R124.1 R128.1 U8.1(OUT)
NetC83_2: C83.2 R127.2 U8.2(-)
NetC84_1: C84.1 R122.1 R126.2 R127.1
NetC84_2: C84.2 R130.2 R131.1 R132.2
NetC85_1: C85.1 R131.2 U8.3(+)
NetC86_1: C86.1 R133.2 R134.2 R135.1 R139.1 U8.7(OUT)
NetC86_2: C86.2 R138.2 U8.6(-)
NetC87_1: C87.1 R133.1 R137.2 R138.1
NetC87_2: C87.2 R141.2 R142.1 R143.2
NetC88_1: C88.1 R142.2 U8.5(+)
NetR125_2: R125.2 R126.1
NetR129_2: R129.2 R130.1
NetR136_2: R136.2 R137.1
NetR140_2: R140.2 R141.1

### Library data of the parts
C83-C88 = Capacitor: as C15 on sheet usb_2_0
R122-R143 = Resistor: Resistencia
U8 = Opamp_x2: Integrado con 2 operacionales; Cod. Proveedor: 296-22024-1-ND; Proveedor: Digi-Key; Encapsulado: 8-SOIC; Fabricante: Texas Instruments; Link: https://www.digikey.com/product-detail/es/OPA2134UA-2K5/296-22024-1-ND/301154?utm_campaign=buynow&WT.z_cid=ref_octopart_dkc_buynow&utm_medium=aggregator&curr=usd&site=us&utm_source=octopart